# EAGLE design WaldoRevC (EAGLE 7.6.0)

## Sheet 1 of 6: Microcontroller Module
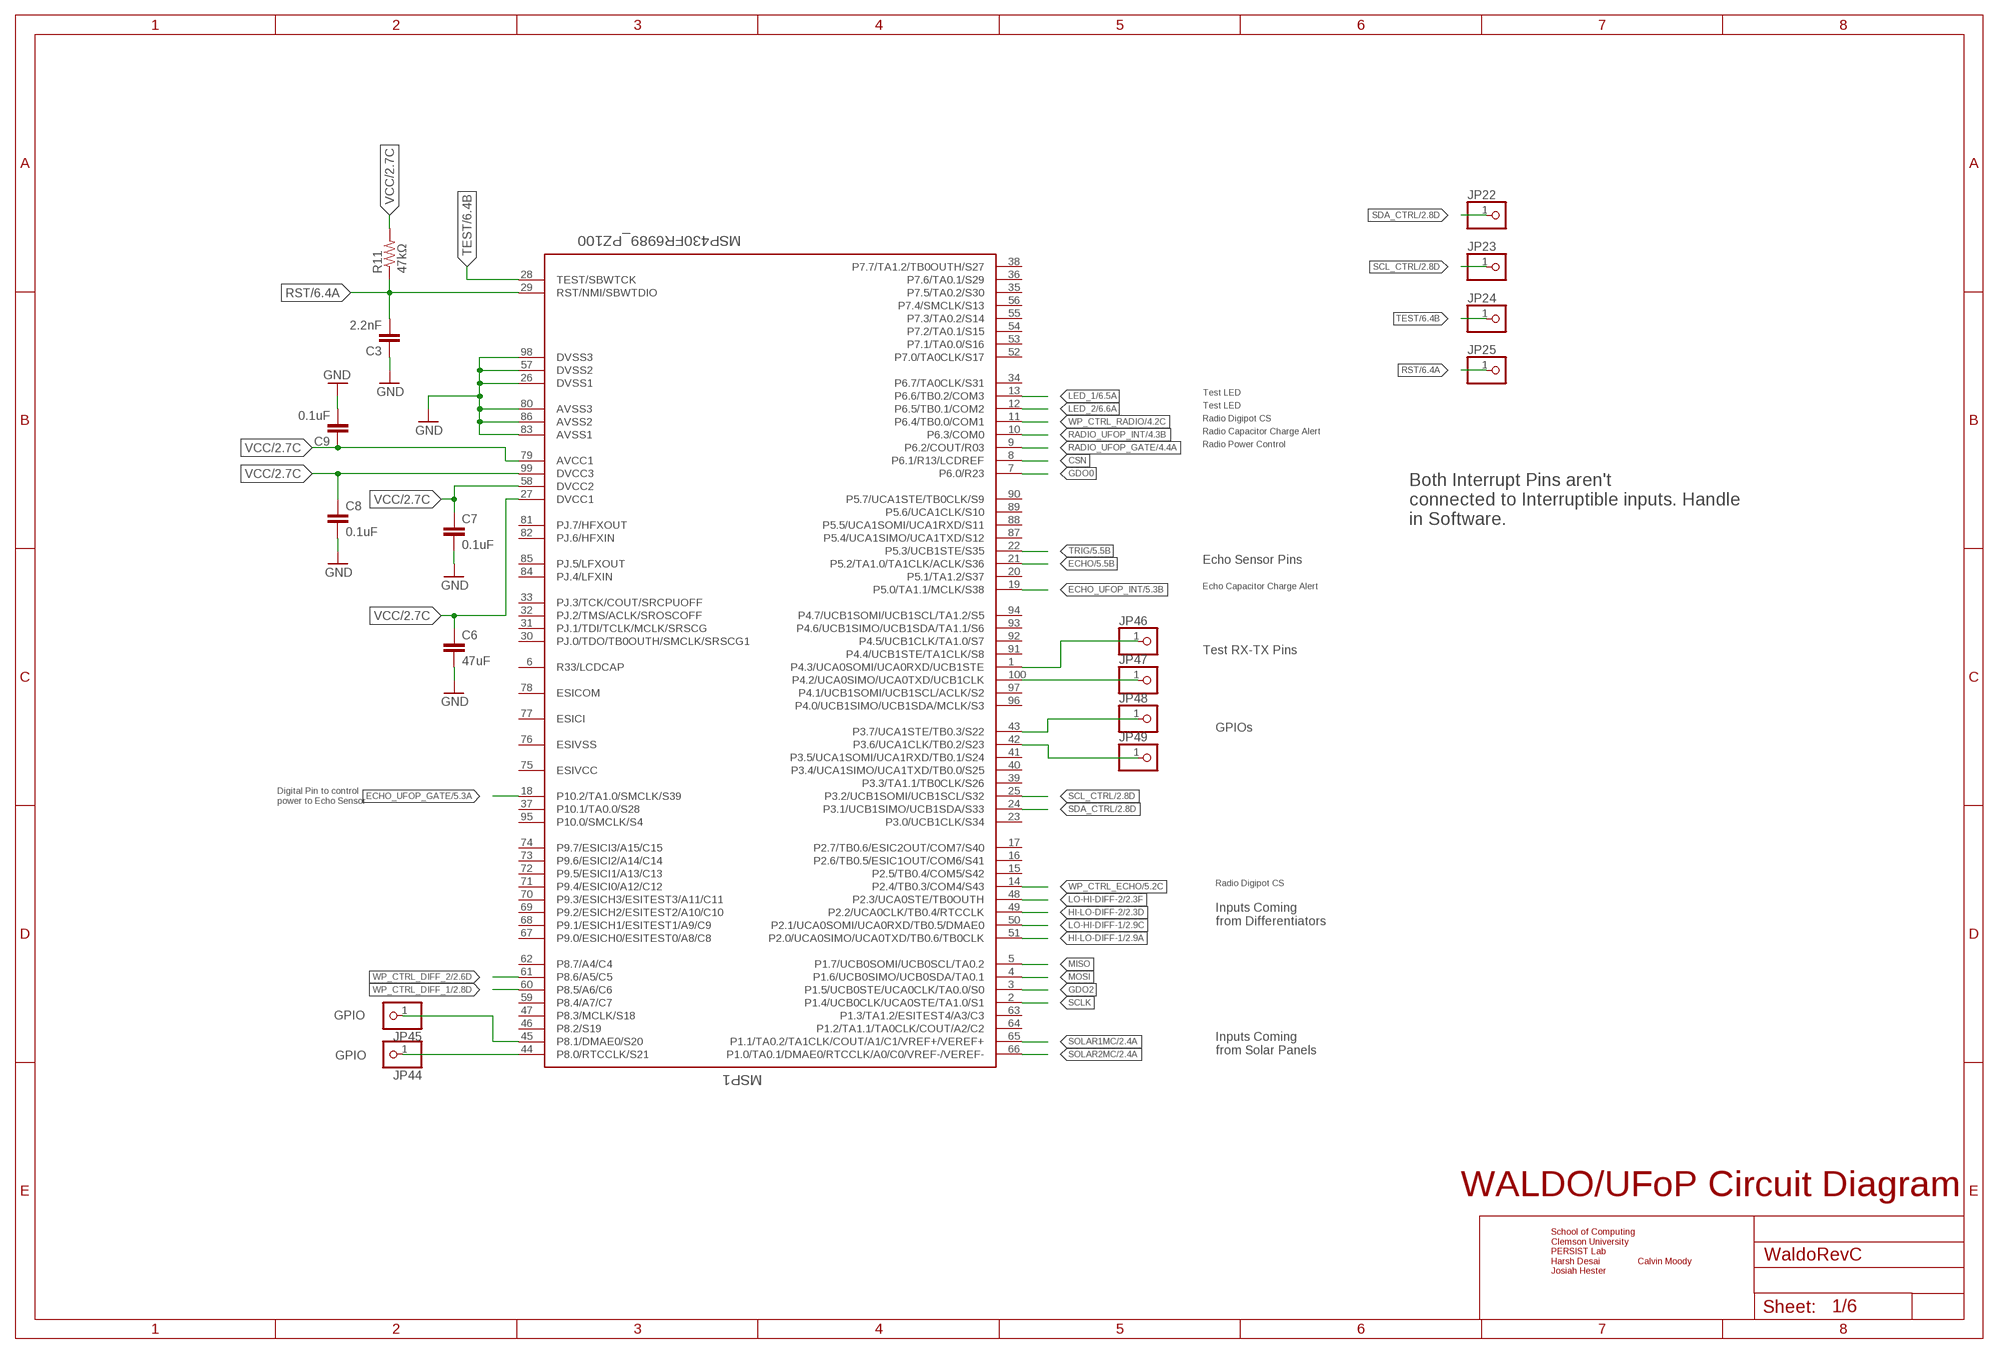
[diagram p0: schematic, sheet 1]

### Parts
C3  2.2nF  CAP0805  [0805]
C6  47uF  CAP0805  [0805]
C7  0.1uF  CAP0805  [0805]
C8  0.1uF  CAP0805  [0805]
C9  0.1uF  CAP0805  [0805]
JP22  PINHD-1X1  [1X01]
JP23  PINHD-1X1  [1X01]
JP24  PINHD-1X1  [1X01]
JP25  PINHD-1X1  [1X01]
JP44  PINHD-1X1  [1X01]
JP45  PINHD-1X1  [1X01]
JP46  PINHD-1X1  [1X01]
JP47  PINHD-1X1  [1X01]
JP48  PINHD-1X1  [1X01]
JP49  PINHD-1X1  [1X01]
MSP1  MSP430FR6989_PZ100  [PZ100]
R11  47kΩ  RESISTOR0805-RES  [0805]

### Nets
CSN: MSP1.8(P6.1/R13/LCDREF) ; also sheet 4
ECHO: MSP1.21(P5.2/TA1.0/TA1CLK/ACLK/S36) ; also sheet 5
ECHO_UFOP_GATE: MSP1.18(P10.2/TA1.0/SMCLK/S39) ; also sheet 5
ECHO_UFOP_INT: MSP1.19(P5.0/TA1.1/MCLK/S38) ; also sheet 5
GDO0: MSP1.7(P6.0/R23) ; also sheet 4
GDO2: MSP1.3(P1.5/UCB0STE/UCA0CLK/TA0.0/S0) ; also sheet 4
GND: C3.1 C6.2 C7.2 C8.2 C9.2 MSP1.26(DVSS1) MSP1.57(DVSS2) MSP1.80(AVSS3) MSP1.83(AVSS1) MSP1.86(AVSS2) MSP1.98(DVSS3) ; also sheet 2,3,4,5,6
HI-LO-DIFF-1: MSP1.51(P2.0/UCA0SIMO/UCA0TXD/TB0.6/TB0CLK) ; also sheet 2
HI-LO-DIFF-2: MSP1.49(P2.2/UCA0CLK/TB0.4/RTCCLK) ; also sheet 2
LED_1: MSP1.13(P6.6/TB0.2/COM3) ; also sheet 6
LED_2: MSP1.12(P6.5/TB0.1/COM2) ; also sheet 6
LO-HI-DIFF-1: MSP1.50(P2.1/UCA0SOMI/UCA0RXD/TB0.5/DMAE0) ; also sheet 2
LO-HI-DIFF-2: MSP1.48(P2.3/UCA0STE/TB0OUTH) ; also sheet 2
MISO: MSP1.5(P1.7/UCB0SOMI/UCB0SCL/TA0.2) ; also sheet 4
MOSI: MSP1.4(P1.6/UCB0SIMO/UCB0SDA/TA0.1) ; also sheet 4
N$1: JP44.1 MSP1.44(P8.0/RTCCLK/S21)
N$2: JP45.1 MSP1.45(P8.1/DMAE0/S20)
N$3: JP46.1 MSP1.1(P4.3/UCA0SOMI/UCA0RXD/UCB1STE)
N$5: JP47.1 MSP1.100(P4.2/UCA0SIMO/UCA0TXD/UCB1CLK)
N$6: JP49.1 MSP1.42(P3.6/UCA1CLK/TB0.2/S23)
N$10: JP48.1 MSP1.43(P3.7/UCA1STE/TB0.3/S22)
RADIO_UFOP_GATE: MSP1.9(P6.2/COUT/R03) ; also sheet 4
RADIO_UFOP_INT: MSP1.10(P6.3/COM0) ; also sheet 4
RST: C3.2 JP25.1 MSP1.29(RST/NMI/SBWTDIO) R11.1 ; also sheet 6
SCL_CTRL: JP23.1 MSP1.25(P3.2/UCB1SOMI/UCB1SCL/S32) ; also sheet 2,4,5,6
SCLK: MSP1.2(P1.4/UCB0CLK/UCA0STE/TA1.0/S1) ; also sheet 4
SDA_CTRL: JP22.1 MSP1.24(P3.1/UCB1SIMO/UCB1SDA/S33) ; also sheet 2,4,5,6
SOLAR1MC: MSP1.65(P1.1/TA0.2/TA1CLK/COUT/A1/C1/VREF+/VEREF+) ; also sheet 2
SOLAR2MC: MSP1.66(P1.0/TA0.1/DMAE0/RTCCLK/A0/C0/VREF-/VEREF-) ; also sheet 2
TEST: JP24.1 MSP1.28(TEST/SBWTCK) ; also sheet 6
TRIG: MSP1.22(P5.3/UCB1STE/S35) ; also sheet 5
VCC: C6.1 C7.1 C8.1 C9.1 MSP1.27(DVCC1) MSP1.58(DVCC2) MSP1.79(AVCC1) MSP1.99(DVCC3) R11.2 ; also sheet 2,3,6
WP_CTRL_DIFF_1: MSP1.60(P8.5/A6/C6) ; also sheet 2
WP_CTRL_DIFF_2: MSP1.61(P8.6/A5/C5) ; also sheet 2
WP_CTRL_ECHO: MSP1.14(P2.4/TB0.3/COM4/S43) ; also sheet 5
WP_CTRL_RADIO: MSP1.11(P6.4/TB0.0/COM1) ; also sheet 4
Unconnected: MSP1.6(R33/LCDCAP) MSP1.15(P2.5/TB0.4/COM5/S42) MSP1.16(P2.6/TB0.5/ESIC1OUT/COM6/S41) MSP1.17(P2.7/TB0.6/ESIC2OUT/COM7/S40) MSP1.20(P5.1/TA1.2/S37) MSP1.23(P3.0/UCB1CLK/S34) MSP1.30(PJ.0/TDO/TB0OUTH/SMCLK/SRSCG1) MSP1.31(PJ.1/TDI/TCLK/MCLK/SRSCG) MSP1.32(PJ.2/TMS/ACLK/SROSCOFF) MSP1.33(PJ.3/TCK/COUT/SRCPUOFF) MSP1.34(P6.7/TA0CLK/S31) MSP1.35(P7.5/TA0.2/S30) MSP1.36(P7.6/TA0.1/S29) MSP1.37(P10.1/TA0.0/S28) MSP1.38(P7.7/TA1.2/TB0OUTH/S27) MSP1.39(P3.3/TA1.1/TB0CLK/S26) MSP1.40(P3.4/UCA1SIMO/UCA1TXD/TB0.0/S25) MSP1.41(P3.5/UCA1SOMI/UCA1RXD/TB0.1/S24) MSP1.46(P8.2/S19) MSP1.47(P8.3/MCLK/S18) MSP1.52(P7.0/TA0CLK/S17) MSP1.53(P7.1/TA0.0/S16) MSP1.54(P7.2/TA0.1/S15) MSP1.55(P7.3/TA0.2/S14) MSP1.56(P7.4/SMCLK/S13) MSP1.59(P8.4/A7/C7) MSP1.62(P8.7/A4/C4) MSP1.63(P1.3/TA1.2/ESITEST4/A3/C3) MSP1.64(P1.2/TA1.1/TA0CLK/COUT/A2/C2) MSP1.67(P9.0/ESICH0/ESITEST0/A8/C8) MSP1.68(P9.1/ESICH1/ESITEST1/A9/C9) MSP1.69(P9.2/ESICH2/ESITEST2/A10/C10) MSP1.70(P9.3/ESICH3/ESITEST3/A11/C11) MSP1.71(P9.4/ESICI0/A12/C12) MSP1.72(P9.5/ESICI1/A13/C13) MSP1.73(P9.6/ESICI2/A14/C14) MSP1.74(P9.7/ESICI3/A15/C15) MSP1.75(ESIVCC) MSP1.76(ESIVSS) MSP1.77(ESICI) MSP1.78(ESICOM) MSP1.81(PJ.7/HFXOUT) MSP1.82(PJ.6/HFXIN) MSP1.84(PJ.4/LFXIN) MSP1.85(PJ.5/LFXOUT) MSP1.87(P5.4/UCA1SIMO/UCA1TXD/S12) MSP1.88(P5.5/UCA1SOMI/UCA1RXD/S11) MSP1.89(P5.6/UCA1CLK/S10) MSP1.90(P5.7/UCA1STE/TB0CLK/S9) MSP1.91(P4.4/UCB1STE/TA1CLK/S8) MSP1.92(P4.5/UCB1CLK/TA1.0/S7) MSP1.93(P4.6/UCB1SIMO/UCB1SDA/TA1.1/S6) MSP1.94(P4.7/UCB1SOMI/UCB1SCL/TA1.2/S5) MSP1.95(P10.0/SMCLK/S4) MSP1.96(P4.0/UCB1SIMO/UCB1SDA/MCLK/S3) MSP1.97(P4.1/UCB1SOMI/UCB1SCL/ACLK/S2)

### Notes on the sheet
- Test LED
- Test LED
- Radio Digipot CS
- Radio Capacitor Charge Alert
- Radio Power Control
- Both Interrupt Pins aren't 
  connected to Interruptible inputs. Handle
  in Software.
- Echo Sensor Pins
- Echo Capacitor Charge Alert
- Test RX-TX Pins
- GPIOs
- Digital Pin to control 
  power to Echo Sensor
- Radio Digipot CS
- Inputs Coming 
  from Differentiators
- GPIO
- Inputs Coming 
  from Solar Panels
- GPIO
- WALDO/UFoP Circuit Diagram
- School of Computing
  Clemson University
  PERSIST Lab
  Harsh Desai               Calvin Moody
  Josiah Hester

## Sheet 2 of 6: Solar Panels + Processing (Differentiators)
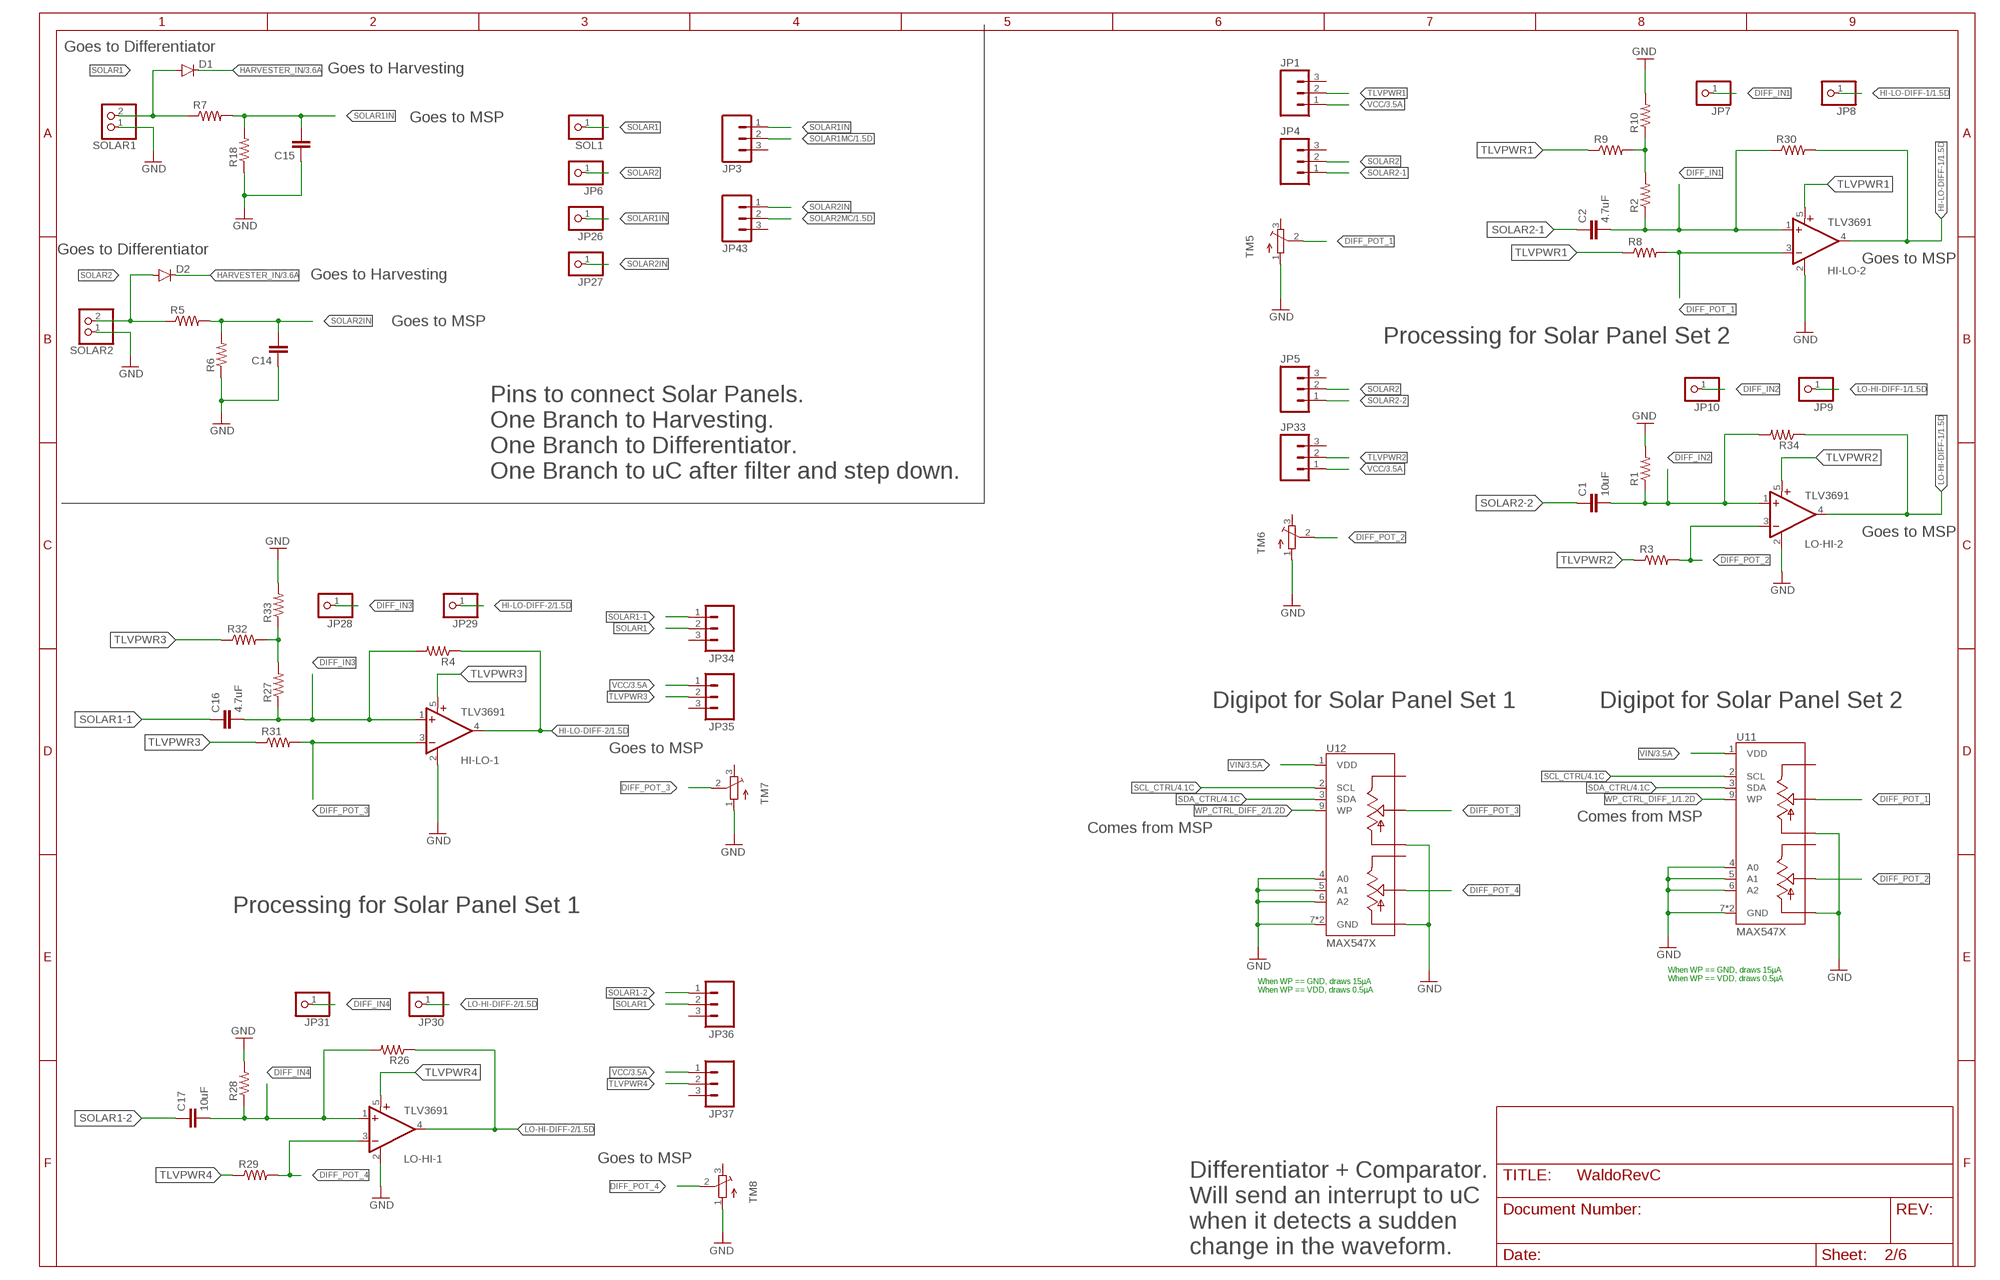
[diagram p1: schematic, sheet 2]

### Parts
C1  10uF  CAP0805  [0805]
C2  4.7uF  CAP0805  [0805]
C14  CAP0805  [0805]
C15  CAP0805  [0805]
C16  4.7uF  CAP0805  [0805]
C17  10uF  CAP0805  [0805]
D1  DIODESOD523  [SOD523]
D2  DIODESOD523  [SOD523]
HI-LO-1  TLV3691  [SC70-5]
HI-LO-2  TLV3691  [SC70-5]
JP1  M03  [1X03-1.27MM]
JP3  M03  [1X03-1.27MM]
JP4  M03  [1X03-1.27MM]
JP5  M03  [1X03-1.27MM]
JP6  PINHD-1X1  [1X01]
JP7  PINHD-1X1  [1X01]
JP8  PINHD-1X1  [1X01]
JP9  PINHD-1X1  [1X01]
JP10  PINHD-1X1  [1X01]
JP26  PINHD-1X1  [1X01]
JP27  PINHD-1X1  [1X01]
JP28  PINHD-1X1  [1X01]
JP29  PINHD-1X1  [1X01]
JP30  PINHD-1X1  [1X01]
JP31  PINHD-1X1  [1X01]
JP33  M03  [1X03-1.27MM]
JP34  M03  [1X03-1.27MM]
JP35  M03  [1X03-1.27MM]
JP36  M03  [1X03-1.27MM]
JP37  M03  [1X03-1.27MM]
JP43  M03  [1X03-1.27MM]
LO-HI-1  TLV3691  [SC70-5]
LO-HI-2  TLV3691  [SC70-5]
R1  RESISTOR0805-RES  [0805]
R2  RESISTOR0805-RES  [0805]
R3  RESISTOR0805-RES  [0805]
R4  RESISTOR0805-RES  [0805]
R5  RESISTOR0805-RES  [0805]
R6  RESISTOR0805-RES  [0805]
R7  RESISTOR0805-RES  [0805]
R8  RESISTOR0805-RES  [0805]
R9  RESISTOR0805-RES  [0805]
R10  RESISTOR0805-RES  [0805]
R18  RESISTOR0805-RES  [0805]
R26  RESISTOR0805-RES  [0805]
R27  RESISTOR0805-RES  [0805]
R28  RESISTOR0805-RES  [0805]
R29  RESISTOR0805-RES  [0805]
R30  RESISTOR0805-RES  [0805]
R31  RESISTOR0805-RES  [0805]
R32  RESISTOR0805-RES  [0805]
R33  RESISTOR0805-RES  [0805]
R34  RESISTOR0805-RES  [0805]
SOL1  PINHD-1X1  [1X01]
SOLAR1  PINHD-1X2  [1X02]
SOLAR2  PINHD-1X2  [1X02]
TM5  TRIMPOTTC33X  [TC33X]
TM6  TRIMPOTTC33X  [TC33X]
TM7  TRIMPOTTC33X  [TC33X]
TM8  TRIMPOTTC33X  [TC33X]
U11  MAX547X  [QFN16]
U12  MAX547X  [QFN16]

### Nets
DIFF_IN1: C2.2 HI-LO-2.1(+IN) JP7.1 R2.1 R30.1
DIFF_IN2: C1.2 JP10.1 LO-HI-2.1(+IN) R1.1 R34.2
DIFF_IN3: C16.2 HI-LO-1.1(+IN) JP28.1 R4.2 R27.1
DIFF_IN4: C17.2 JP31.1 LO-HI-1.1(+IN) R26.2 R28.1
DIFF_POT_1: HI-LO-2.3(-IN) R8.2 TM5.2(S) U11.14(WA)
DIFF_POT_2: LO-HI-2.3(-IN) R3.2 TM6.2(S) U11.11(WB)
DIFF_POT_3: HI-LO-1.3(-IN) R31.2 TM7.2(S) U12.14(WA)
DIFF_POT_4: LO-HI-1.3(-IN) R29.2 TM8.2(S) U12.11(WB)
GND: C14.1 C15.1 HI-LO-1.2(GND) HI-LO-2.2(GND) LO-HI-1.2(GND) LO-HI-2.2(GND) R1.2 R6.1 R10.2 R18.1 R28.2 R33.2 SOLAR1.1 SOLAR2.1 TM5.1(A) TM6.1(A) TM7.1(A) TM8.1(A) U11.4(A0) U11.5(A1) U11.6(A2) U11.7(GND) U11.10(LB) U11.13(LA) U11.TH(GND) U12.4(A0) U12.5(A1) U12.6(A2) U12.7(GND) U12.10(LB) U12.13(LA) U12.TH(GND) ; also sheet 1,3,4,5,6
HARVESTER_IN: D1.C D2.C ; also sheet 3
HI-LO-DIFF-1: HI-LO-2.4(OUT) JP8.1 R30.2 ; also sheet 1
HI-LO-DIFF-2: HI-LO-1.4(OUT) JP29.1 R4.1 ; also sheet 1
LO-HI-DIFF-1: JP9.1 LO-HI-2.4(OUT) R34.1 ; also sheet 1
LO-HI-DIFF-2: JP30.1 LO-HI-1.4(OUT) R26.1 ; also sheet 1
N$4: R27.2 R32.2 R33.1
N$8: R2.2 R9.2 R10.1
SCL_CTRL: U11.2(SCL) U12.2(SCL) ; also sheet 1,4,5,6
SDA_CTRL: U11.3(SDA) U12.3(SDA) ; also sheet 1,4,5,6
SOLAR1: D1.A JP34.2 JP36.2 R7.1 SOL1.1 SOLAR1.2
SOLAR1-1: C16.1 JP34.1
SOLAR1-2: C17.1 JP36.1
SOLAR1IN: C15.2 JP3.1 JP26.1 R7.2 R18.2
SOLAR1MC: JP3.2 ; also sheet 1
SOLAR2: D2.A JP4.2 JP5.2 JP6.1 R5.1 SOLAR2.2
SOLAR2-1: C2.1 JP4.1
SOLAR2-2: C1.1 JP5.1
SOLAR2IN: C14.2 JP27.1 JP43.1 R5.2 R6.2
SOLAR2MC: JP43.2 ; also sheet 1
TLVPWR1: HI-LO-2.5(V+) JP1.2 R8.1 R9.1
TLVPWR2: JP33.2 LO-HI-2.5(V+) R3.1
TLVPWR3: HI-LO-1.5(V+) JP35.2 R31.1 R32.1
TLVPWR4: JP37.2 LO-HI-1.5(V+) R29.1
VCC: JP1.1 JP33.1 JP35.1 JP37.1 ; also sheet 1,3,6
VIN: U11.1(VDD) U12.1(VDD) ; also sheet 3,4,5,6
WP_CTRL_DIFF_1: U11.9(WP) ; also sheet 1
WP_CTRL_DIFF_2: U12.9(WP) ; also sheet 1
Unconnected: JP1.3 JP3.3 JP4.3 JP5.3 JP33.3 JP34.3 JP35.3 JP36.3 JP37.3 JP43.3 TM5.3(E) TM6.3(E) TM7.3(E) TM8.3(E) U11.12(HB) U11.15(HA) U12.12(HB) U12.15(HA)

### Notes on the sheet
- Goes to Differentiator
- Goes to Harvesting
- Goes to MSP
- Goes to Differentiator
- Goes to MSP
- Goes to Harvesting
- Goes to MSP
- Processing for Solar Panel Set 2
- Pins to connect Solar Panels.
  One Branch to Harvesting.
  One Branch to Differentiator.
  One Branch to uC after filter and step down.
- Goes to MSP
- Digipot for Solar Panel Set 1 | Digipot for Solar Panel Set 2
- Goes to MSP
- Comes from MSP
- Comes from MSP
- Processing for Solar Panel Set 1
- When WP == GND, draws 15µA
  When WP == VDD, draws 0.5µA
- When WP == GND, draws 15µA
  When WP == VDD, draws 0.5µA
- Goes to MSP
- Differentiator + Comparator.
  Will send an interrupt to uC 
  when it detects a sudden 
  change in the waveform.

## Sheet 3 of 6: Battery + Regulator
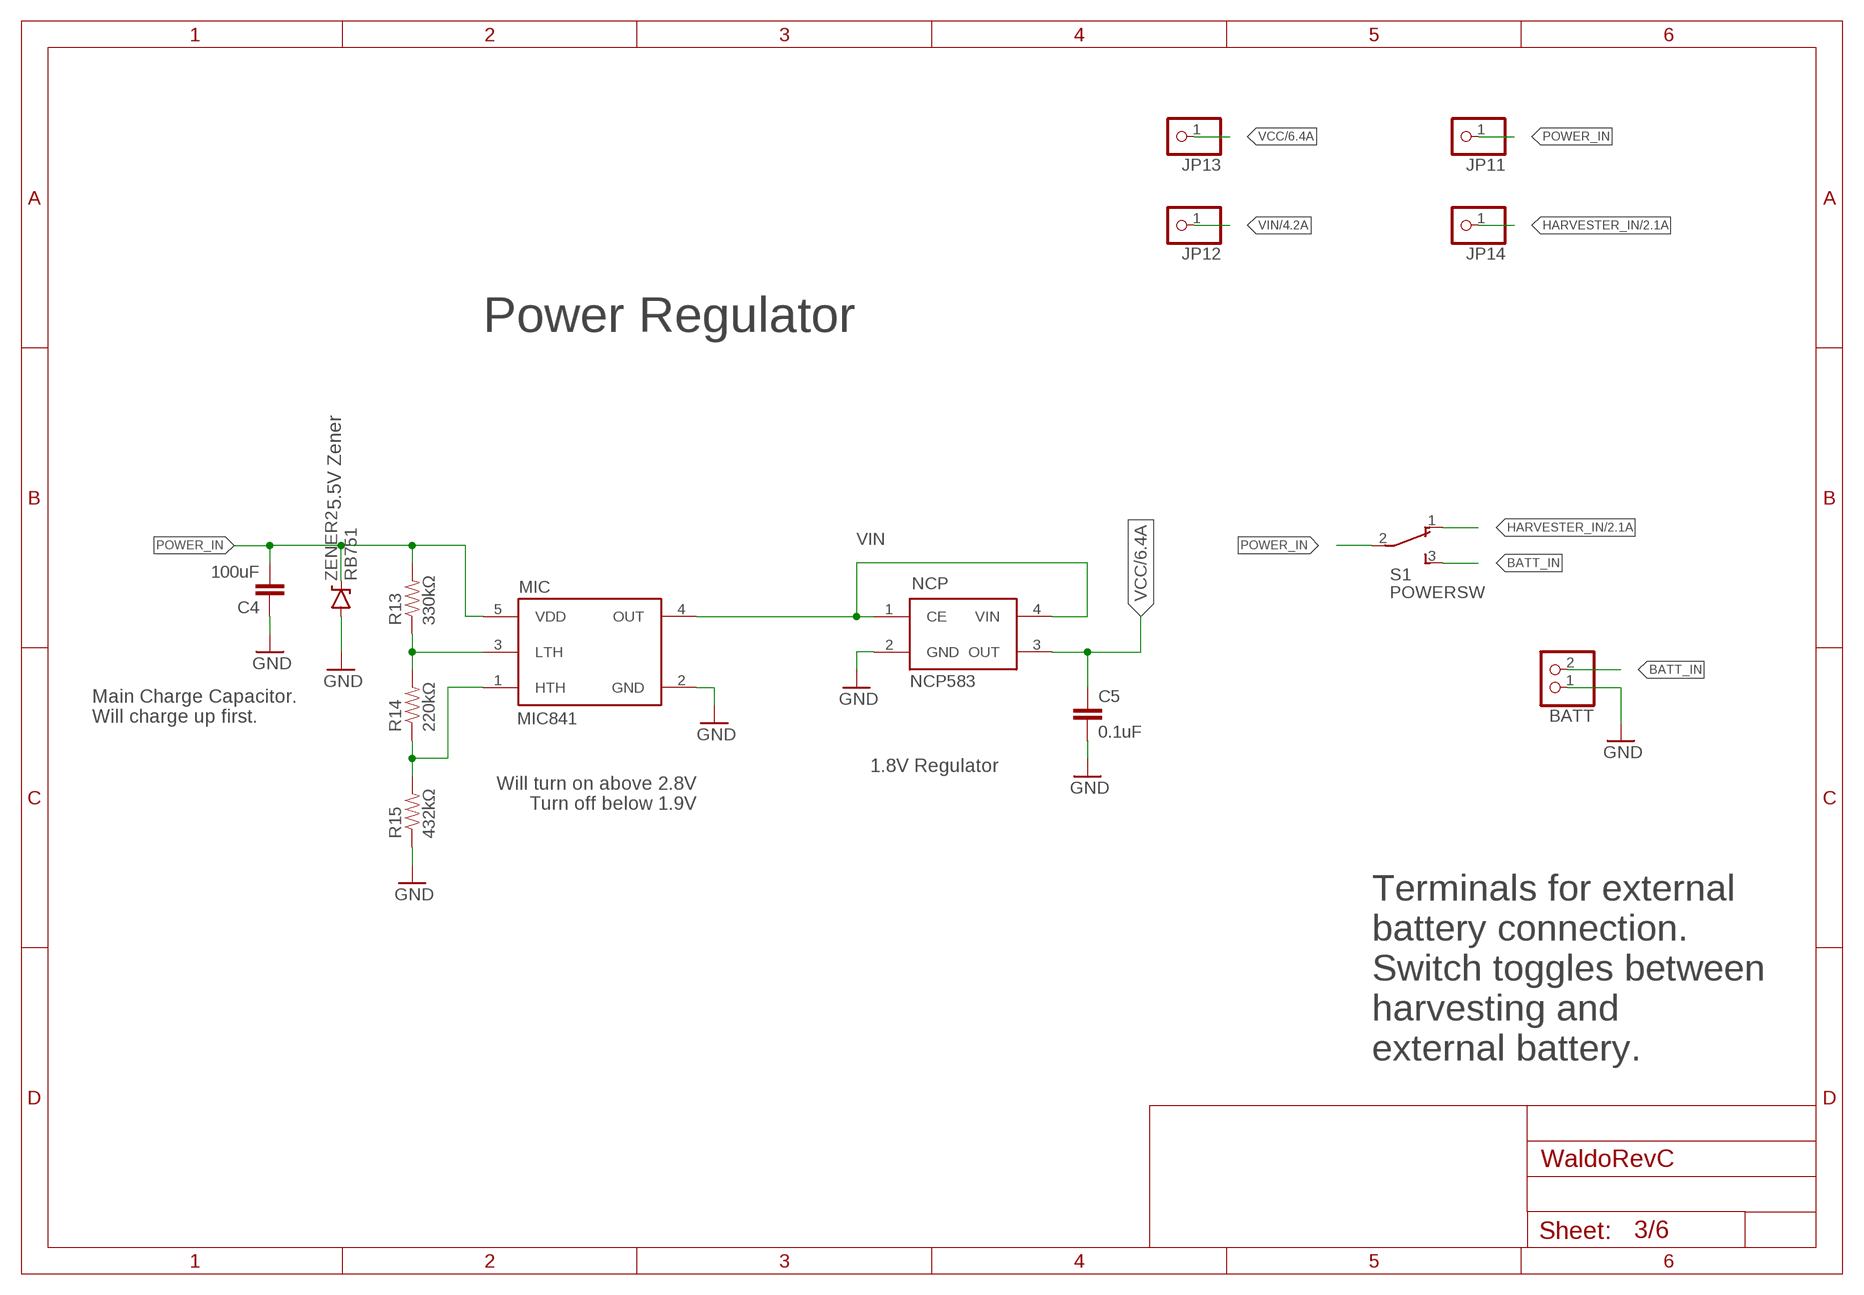
[diagram p2: schematic, sheet 3]

### Parts
BATT  PINHD-1X2  [1X02]
C4  100uF  CAP0805  [0805]
C5  0.1uF  CAP0805  [0805]
JP11  PINHD-1X1  [1X01]
JP12  PINHD-1X1  [1X01]
JP13  PINHD-1X1  [1X01]
JP14  PINHD-1X1  [1X01]
MIC  MIC841  [SC70-5]
NCP  NCP583  [SC82-AB_1PRIMARY]
R13  330kΩ  RESISTOR0805-RES  [0805]
R14  220kΩ  RESISTOR0805-RES  [0805]
R15  432kΩ  RESISTOR0805-RES  [0805]
S1  POWERSW  [TL3XYO]
ZENER2  RB751  DIODE-ZENER  [SOD-523]

### Nets
BATT_IN: BATT.2 S1.3(S)
GND: BATT.1 C4.1 C5.2 MIC.2(GND) NCP.2(GND) R15.1 ZENER2.ANODE(A) ; also sheet 1,2,4,5,6
HARVESTER_IN: JP14.1 S1.1(O) ; also sheet 2
N$11: MIC.3(LTH) R13.1 R14.2
N$12: MIC.1(HTH) R14.1 R15.2
POWER_IN: C4.2 JP11.1 MIC.5(VDD) R13.2 S1.2(P) ZENER2.CATHODE(C)
VCC: C5.1 JP13.1 NCP.3(OUT) ; also sheet 1,2,6
VIN: JP12.1 MIC.4(OUT) NCP.1(CE) NCP.4(VIN) ; also sheet 2,4,5,6

### Notes on the sheet
- Power Regulator
- 5.5V Zener
- Main Charge Capacitor.
  Will charge up first.
- 1.8V Regulator
- Will turn on above 2.8V
  Turn off below 1.9V
- Terminals for external
  battery connection.
  Switch toggles between
  harvesting and 
  external battery.

## Sheet 4 of 6: Radio Module
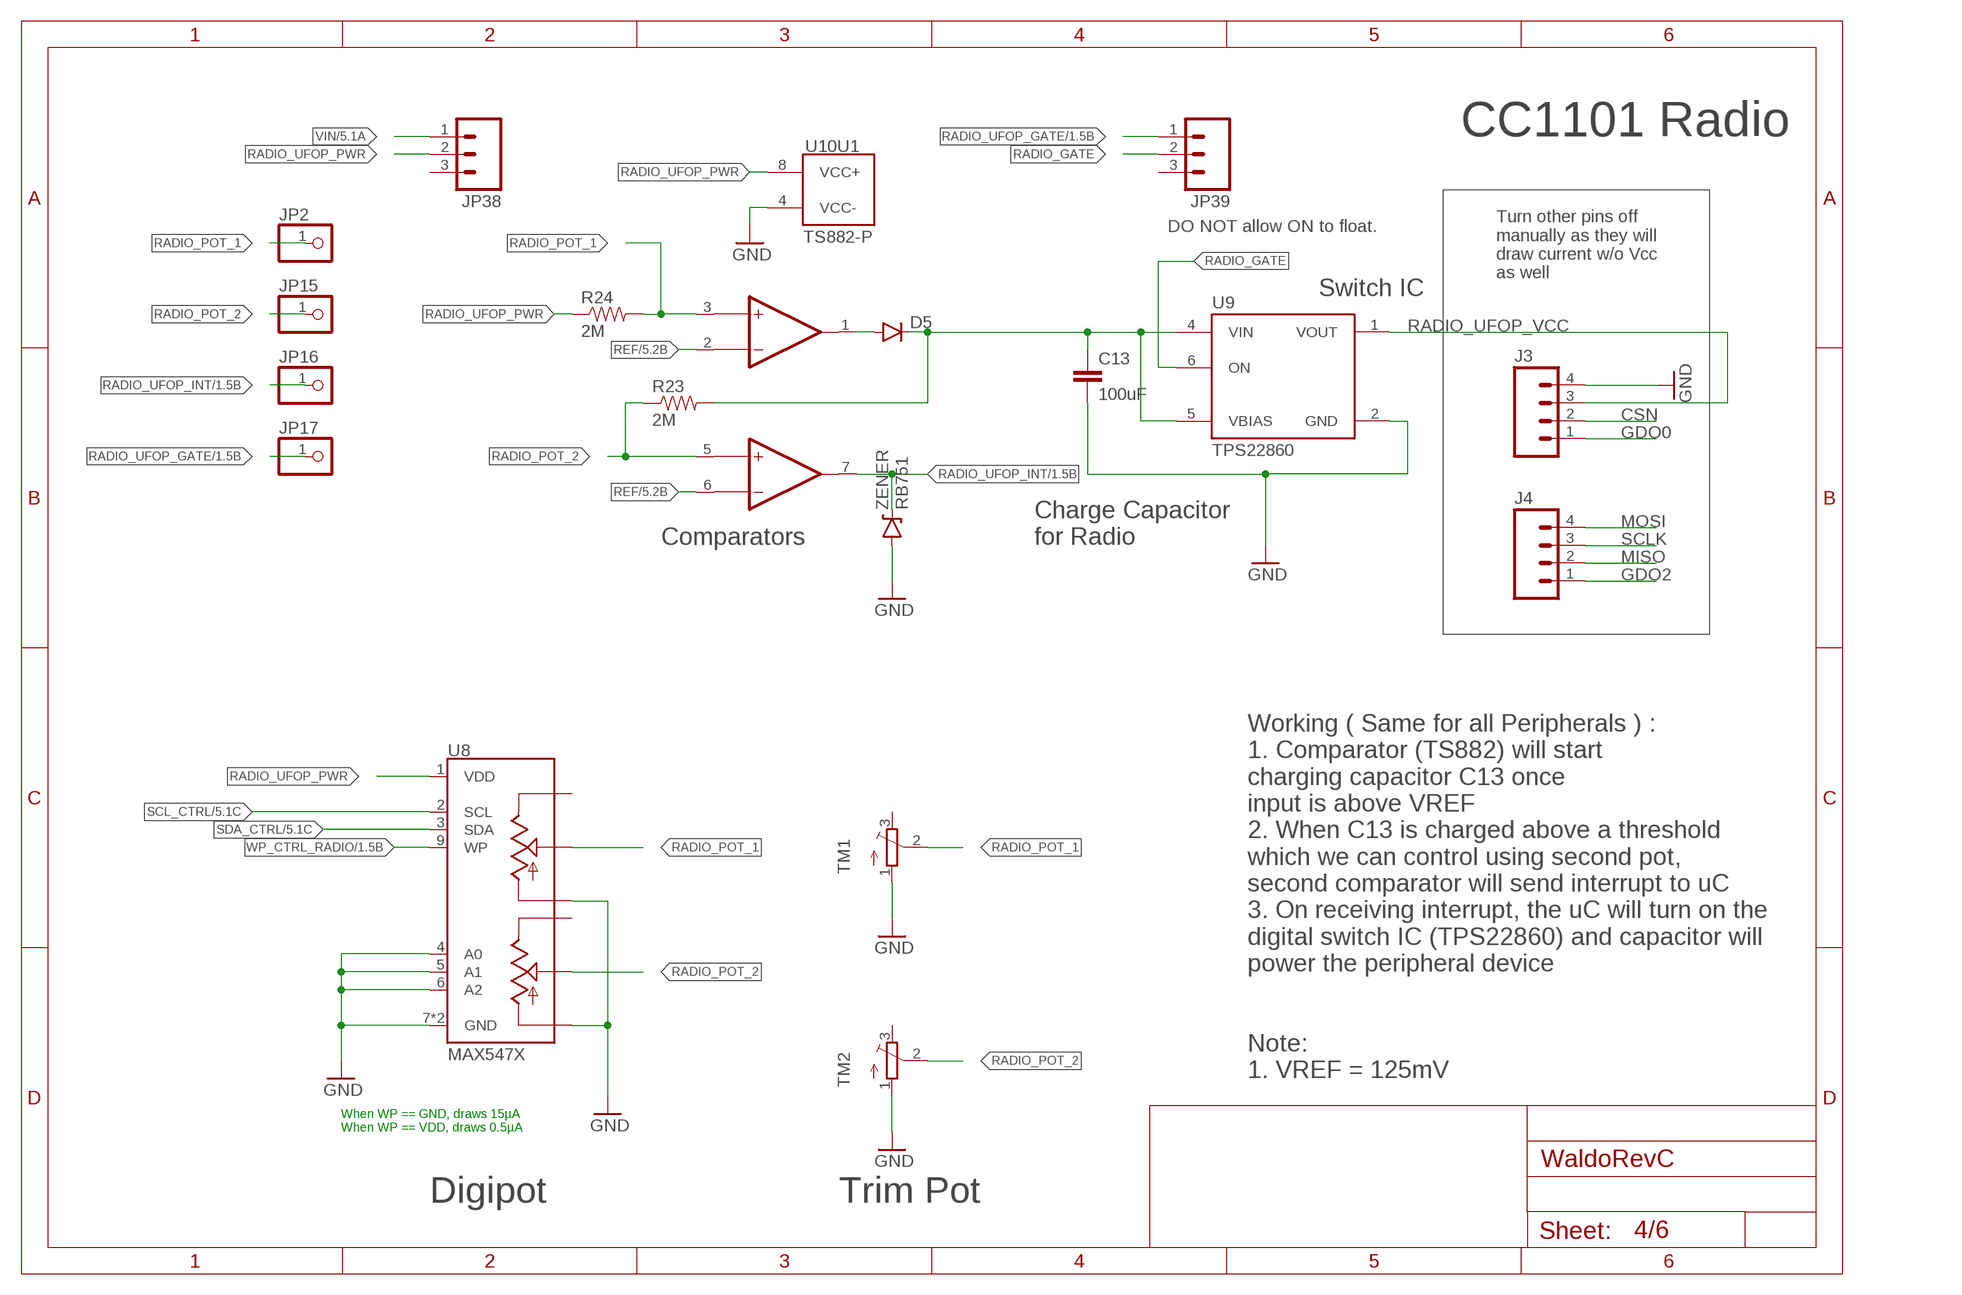
[diagram p3: schematic, sheet 4]

### Parts
C13  100uF  CAP0805  [0805]
D5  DIODESOD523  [SOD523]
J3  M04PTH  [1X04]
J4  M04PTH  [1X04]
JP2  PINHD-1X1  [1X01]
JP15  PINHD-1X1  [1X01]
JP16  PINHD-1X1  [1X01]
JP17  PINHD-1X1  [1X01]
JP38  M03  [1X03-1.27MM]
JP39  M03  [1X03-1.27MM]
R23  2M  RESISTOR0805-RES  [0805]
R24  2M  RESISTOR0805-RES  [0805]
TM1  TRIMPOTTC33X  [TC33X]
TM2  TRIMPOTTC33X  [TC33X]
U8  MAX547X  [QFN16]
U9  TPS22860  [TSOT23-6]
U10  TS882-P  [UDFN8]
ZENER  RB751  DIODE-ZENER  [SOD-523]

### Nets
CSN: J3.2 ; also sheet 1
GDO0: J3.1 ; also sheet 1
GDO2: J4.1 ; also sheet 1
GND: C13.2 J3.4 TM1.1(A) TM2.1(A) U8.4(A0) U8.5(A1) U8.6(A2) U8.7(GND) U8.10(LB) U8.13(LA) U8.TH(GND) U9.2(GND) U10.4(U1:VCC-) ZENER.ANODE(A) ; also sheet 1,2,3,5,6
MISO: J4.2 ; also sheet 1
MOSI: J4.4 ; also sheet 1
N$22: C13.1 D5.C R23.2 U9.4(VIN) U9.5(VBIAS)
N$24: D5.A U10.1(OP1:OUT1)
RADIO_GATE: JP39.2 U9.6(ON)
RADIO_POT_1: JP2.1 R24.2 TM1.2(S) U8.14(WA) U10.3(OP1:IN1+)
RADIO_POT_2: JP15.1 R23.1 TM2.2(S) U8.11(WB) U10.5(OP2:IN1+)
RADIO_UFOP_GATE: JP17.1 JP39.1 ; also sheet 1
RADIO_UFOP_INT: JP16.1 U10.7(OP2:OUT1) ZENER.CATHODE(C) ; also sheet 1
RADIO_UFOP_PWR: JP38.2 R24.1 U8.1(VDD) U10.8(U1:VCC+)
RADIO_UFOP_VCC: J3.3 U9.1(VOUT)
REF: U10.2(OP1:IN1-) U10.6(OP2:IN1-) ; also sheet 5,6
SCL_CTRL: U8.2(SCL) ; also sheet 1,2,5,6
SCLK: J4.3 ; also sheet 1
SDA_CTRL: U8.3(SDA) ; also sheet 1,2,5,6
VIN: JP38.1 ; also sheet 2,3,5,6
WP_CTRL_RADIO: U8.9(WP) ; also sheet 1
Unconnected: JP38.3 JP39.3 TM1.3(E) TM2.3(E) U8.12(HB) U8.15(HA)

### Notes on the sheet
- CC1101 Radio
- DO NOT allow ON to float.
- Turn other pins off 
  manually as they will
  draw current w/o Vcc
  as well
- Switch IC
- Comparators
- Charge Capacitor 
  for Radio
- Working ( Same for all Peripherals ) :
  1. Comparator (TS882) will start 
  charging capacitor C13 once 
  input is above VREF
  2. When C13 is charged above a threshold
  which we can control using second pot, 
  second comparator will send interrupt to uC
  3. On receiving interrupt, the uC will turn on the
  digital switch IC (TPS22860) and capacitor will 
  power the peripheral device
- Note:
  1. VREF = 125mV
- When WP == GND, draws 15µA
  When WP == VDD, draws 0.5µA
- Digipot | Trim Pot

## Sheet 5 of 6: Echo Sensor Module
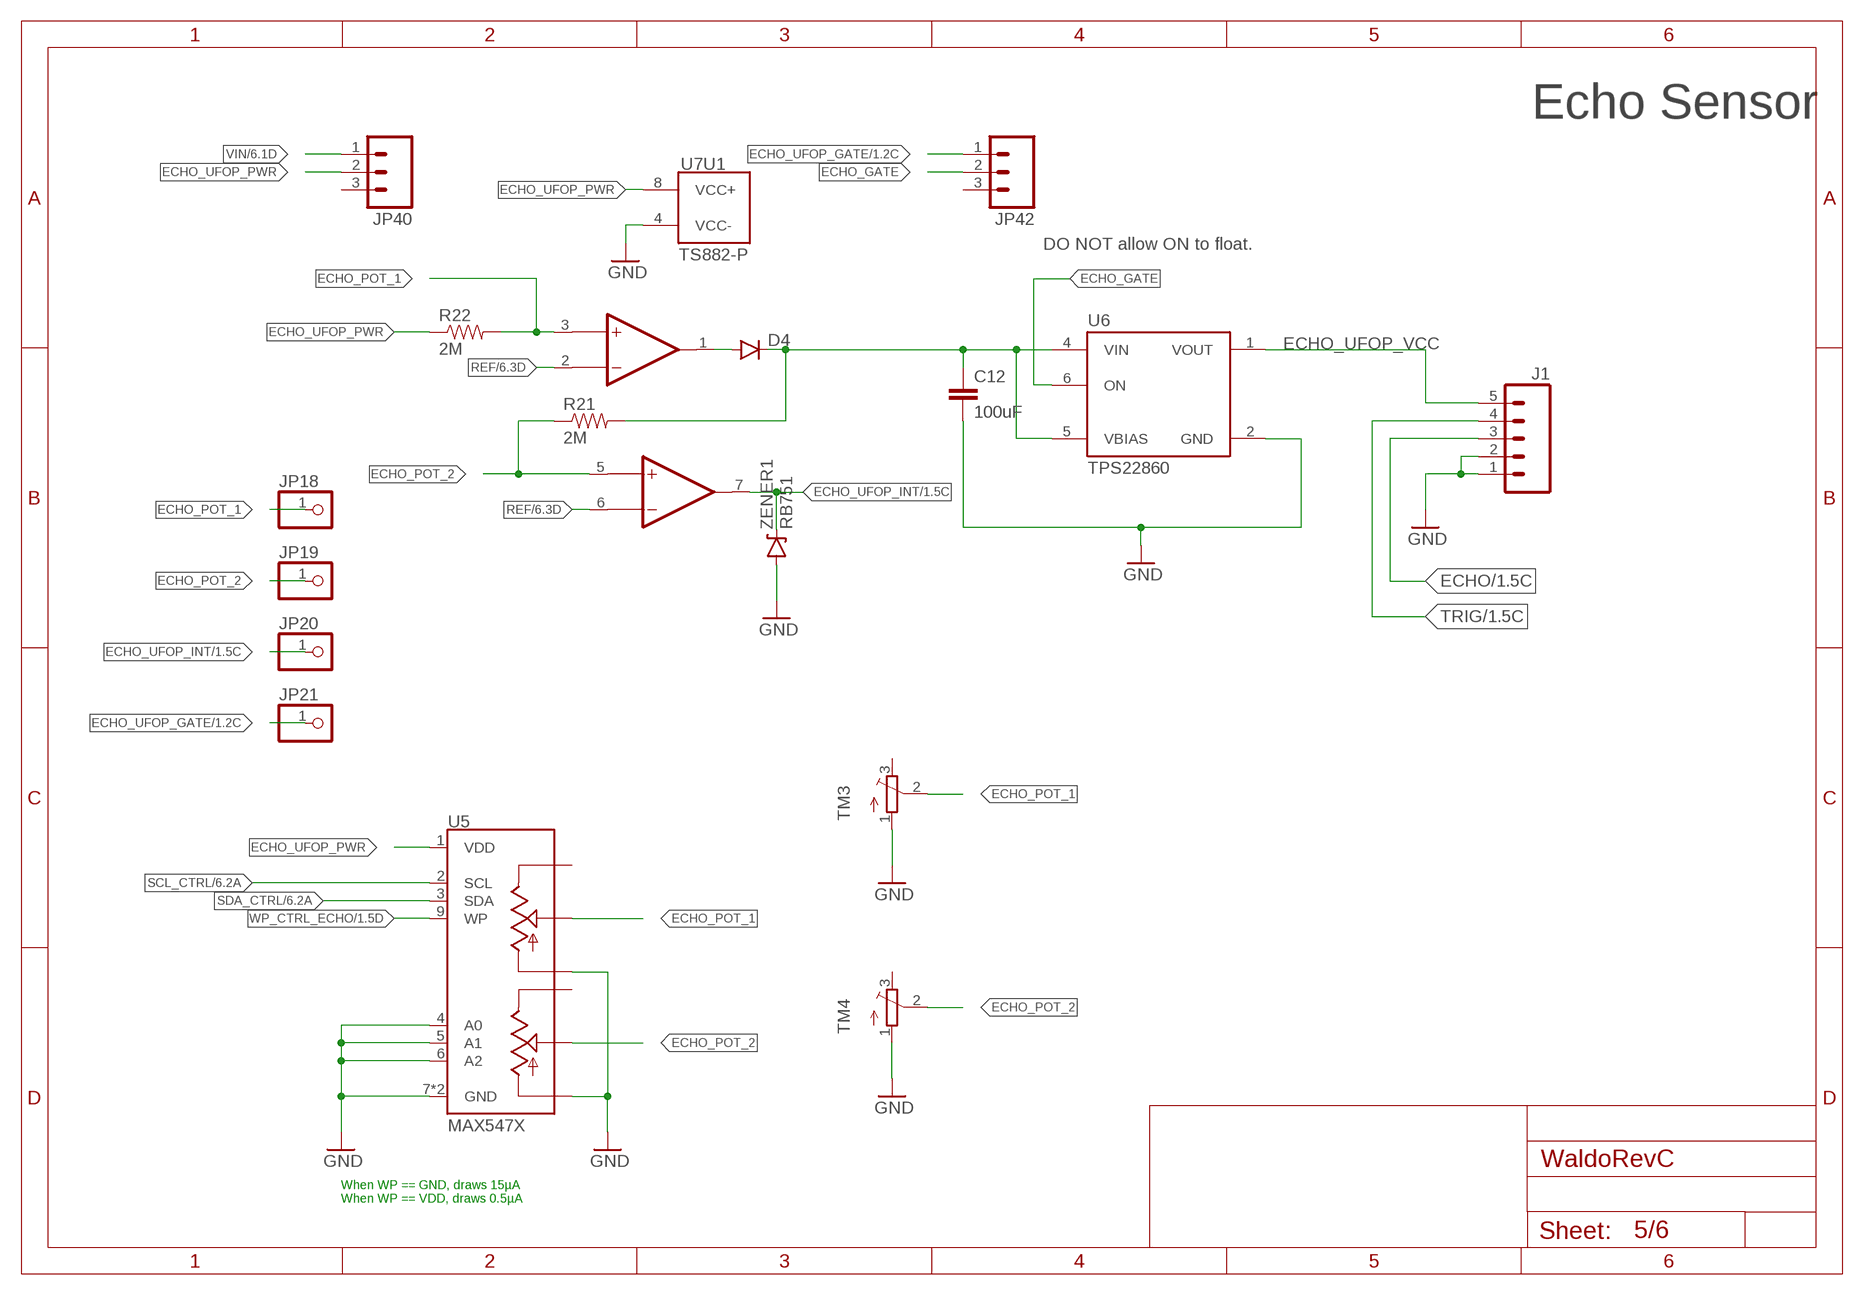
[diagram p4: schematic, sheet 5]

### Parts
C12  100uF  CAP0805  [0805]
D4  DIODESOD523  [SOD523]
J1  M05PTH  [1X05]
JP18  PINHD-1X1  [1X01]
JP19  PINHD-1X1  [1X01]
JP20  PINHD-1X1  [1X01]
JP21  PINHD-1X1  [1X01]
JP40  M03  [1X03-1.27MM]
JP42  M03  [1X03-1.27MM]
R21  2M  RESISTOR0805-RES  [0805]
R22  2M  RESISTOR0805-RES  [0805]
TM3  TRIMPOTTC33X  [TC33X]
TM4  TRIMPOTTC33X  [TC33X]
U5  MAX547X  [QFN16]
U6  TPS22860  [TSOT23-6]
U7  TS882-P  [UDFN8]
ZENER1  RB751  DIODE-ZENER  [SOD-523]

### Nets
ECHO: J1.3 ; also sheet 1
ECHO_GATE: JP42.2 U6.6(ON)
ECHO_POT_1: JP18.1 R22.2 TM3.2(S) U5.14(WA) U7.3(OP1:IN1+)
ECHO_POT_2: JP19.1 R21.1 TM4.2(S) U5.11(WB) U7.5(OP2:IN1+)
ECHO_UFOP_GATE: JP21.1 JP42.1 ; also sheet 1
ECHO_UFOP_INT: JP20.1 U7.7(OP2:OUT1) ZENER1.CATHODE(C) ; also sheet 1
ECHO_UFOP_PWR: JP40.2 R22.1 U5.1(VDD) U7.8(U1:VCC+)
ECHO_UFOP_VCC: J1.5 U6.1(VOUT)
GND: C12.2 J1.1 J1.2 TM3.1(A) TM4.1(A) U5.4(A0) U5.5(A1) U5.6(A2) U5.7(GND) U5.10(LB) U5.13(LA) U5.TH(GND) U6.2(GND) U7.4(U1:VCC-) ZENER1.ANODE(A) ; also sheet 1,2,3,4,6
N$17: C12.1 D4.C R21.2 U6.4(VIN) U6.5(VBIAS)
N$20: D4.A U7.1(OP1:OUT1)
REF: U7.2(OP1:IN1-) U7.6(OP2:IN1-) ; also sheet 4,6
SCL_CTRL: U5.2(SCL) ; also sheet 1,2,4,6
SDA_CTRL: U5.3(SDA) ; also sheet 1,2,4,6
TRIG: J1.4 ; also sheet 1
VIN: JP40.1 ; also sheet 2,3,4,6
WP_CTRL_ECHO: U5.9(WP) ; also sheet 1
Unconnected: JP40.3 JP42.3 TM3.3(E) TM4.3(E) U5.12(HB) U5.15(HA)

### Notes on the sheet
- Echo Sensor
- DO NOT allow ON to float.
- When WP == GND, draws 15µA
  When WP == VDD, draws 0.5µA

## Sheet 6 of 6: Programmer, RTC, Misc
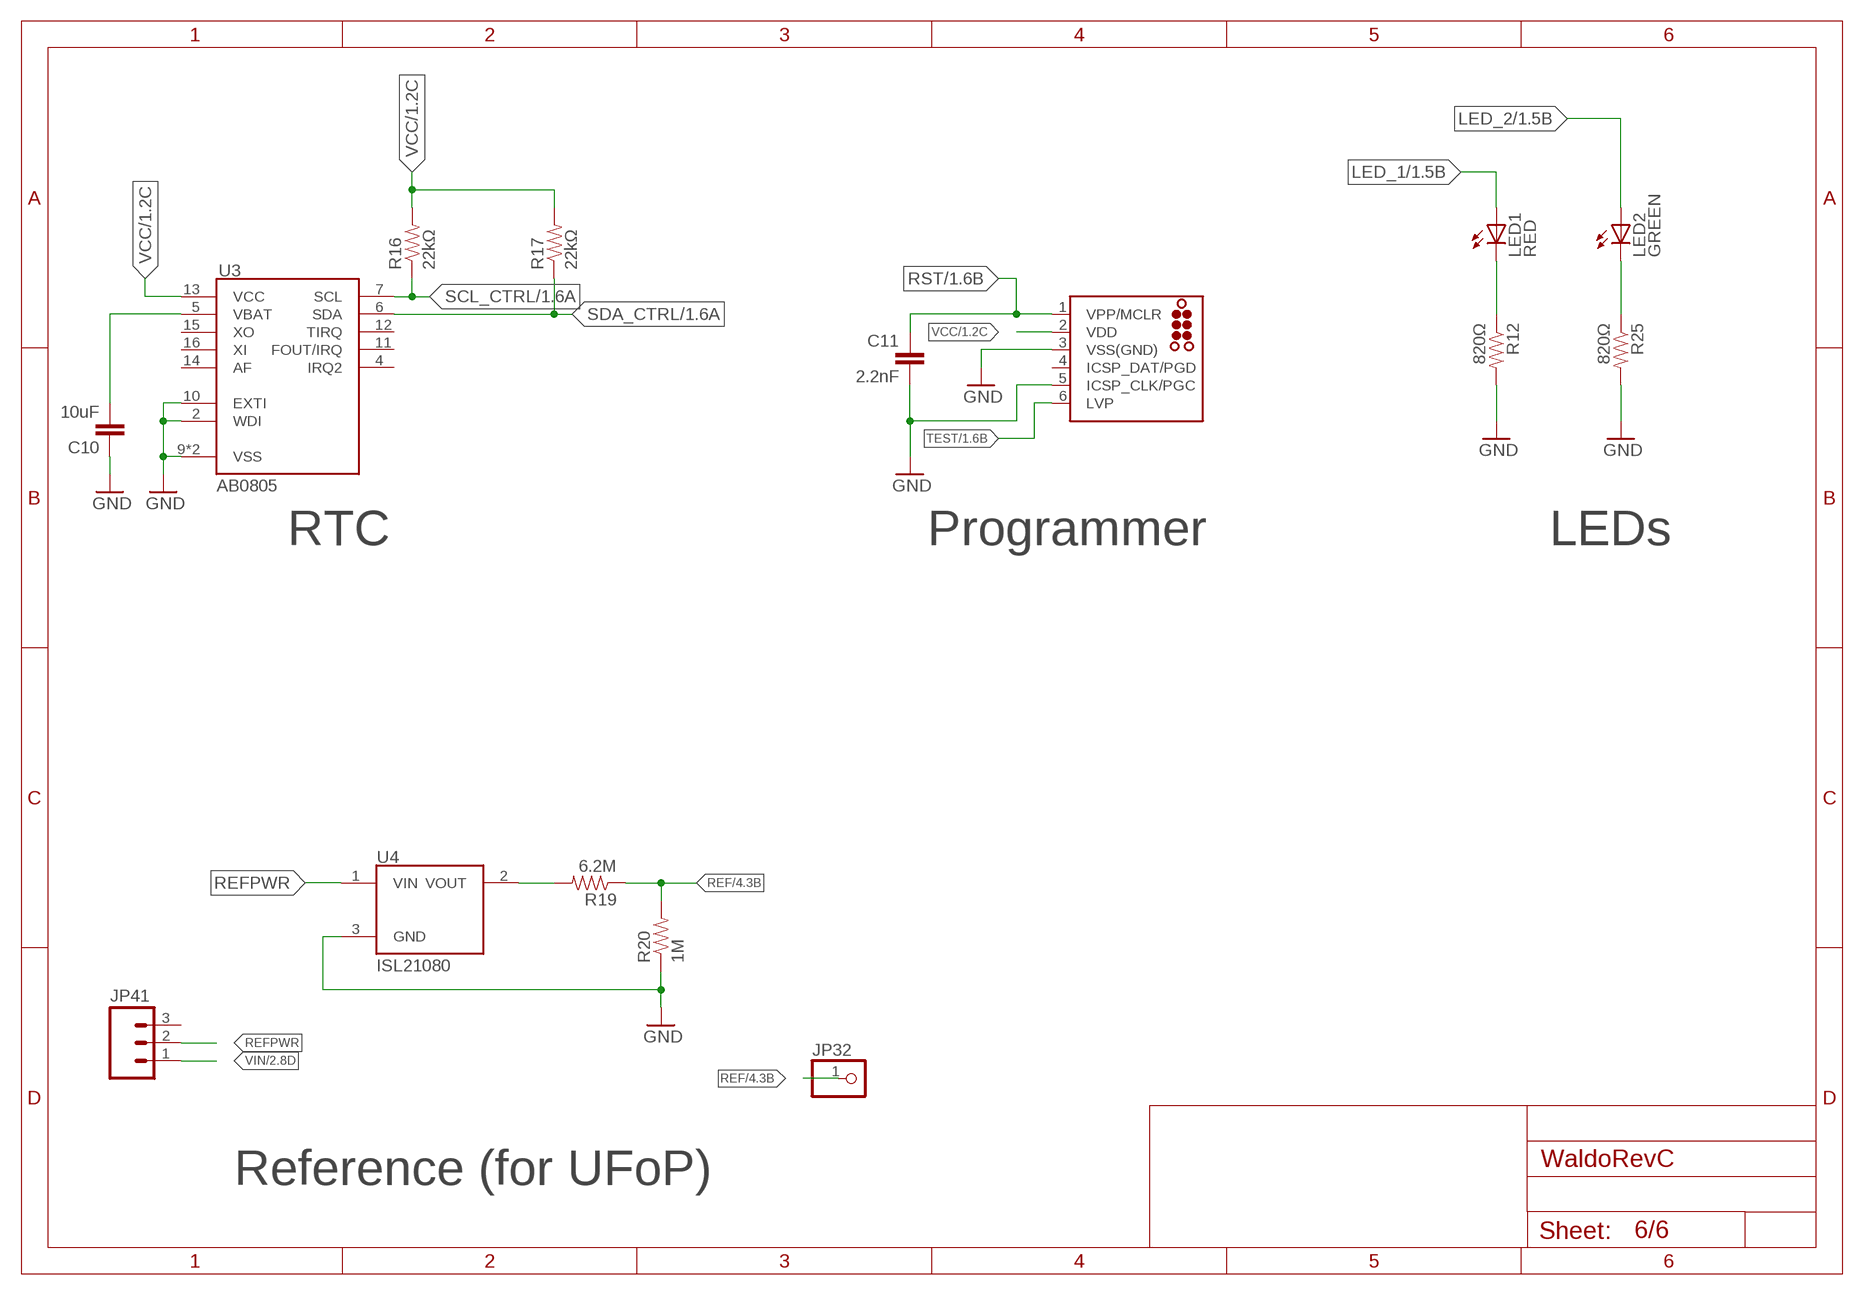
[diagram p5: schematic, sheet 6]

### Parts
C10  10uF  CAP0805  [0805]
C11  2.2nF  CAP0805  [0805]
J2  TC2030-MCP-NL  [TC2030-MCP-NL]
JP32  PINHD-1X1  [1X01]
JP41  M03  [1X03-1.27MM]
LED1  RED  LEDCHIP-LED0805  [CHIP-LED0805]
LED2  GREEN  LEDCHIP-LED0805  [CHIP-LED0805]
R12  820Ω  RESISTOR0805-RES  [0805]
R16  22kΩ  RESISTOR0805-RES  [0805]
R17  22kΩ  RESISTOR0805-RES  [0805]
R19  6.2M  RESISTOR0805-RES  [0805]
R20  1M  RESISTOR0805-RES  [0805]
R25  820Ω  RESISTOR0805-RES  [0805]
U3  AB0805  [QFN16]
U4  ISL21080  [SOT-23]

### Nets
GND: C10.1 C11.2 J2.3(VSS(GND)) J2.5(ICSP_CLK/PGC) R12.2 R20.1 R25.2 U3.2(WDI) U3.9(VSS) U3.10(EXTI) U3.TH(VSS) U4.3(GND) ; also sheet 1,2,3,4,5
LED_1: LED1.A ; also sheet 1
LED_2: LED2.A ; also sheet 1
N$7: LED1.C R12.1
N$9: LED2.C R25.1
N$13: C10.2 U3.5(VBAT)
N$14: R19.2 U4.2(VOUT)
REF: JP32.1 R19.1 R20.2 ; also sheet 4,5
REFPWR: JP41.2 U4.1(VIN)
RST: C11.1 J2.1(VPP/MCLR) ; also sheet 1
SCL_CTRL: R16.1 U3.7(SCL) ; also sheet 1,2,4,5
SDA_CTRL: R17.1 U3.6(SDA) ; also sheet 1,2,4,5
TEST: J2.6(LVP) ; also sheet 1
VCC: J2.2(VDD) R16.2 R17.2 U3.13(VCC) ; also sheet 1,2,3
VIN: JP41.1 ; also sheet 2,3,4,5
Unconnected: J2.4(ICSP_DAT/PGD) JP41.3 U3.4(IRQ2) U3.11(FOUT/IRQ) U3.12(TIRQ) U3.14(AF) U3.15(XO) U3.16(XI)

### Notes on the sheet
- RTC | Programmer | LEDs
- Reference (for UFoP)

## Library data of the parts
BATT SOLAR1 SOLAR2 = pinhead:PINHD-1X2: PIN HEADER
C1-C11 C14-C17 = SparkFun-Capacitors:CAP: Capacitor Standard 0603 ceramic capacitor, and 0.1" leaded capacitor.
C12 C13 = SparkFun-Capacitors:CAP: Capacitor Standard 0603 ceramic capacitor, and 0.1" leaded capacitor.; DIGIKEY: 490-9969-1-ND
D1 D2 D4 D5 = SparkFun-DiscreteSemi:DIODE: Diode These are standard reverse protection diodes and small signal diodes. SMA package can handle up to about 1A. SOD-323 can handle about 200mA. What the SOD-323 package when ordering, there are some mfgs out there that are 5-pin packages.
HI-LO-1 HI-LO-2 LO-HI-1 LO-HI-2 = fedpower:TLV3691: 0.9-V to 6.5-V, Nanopower Comparator Datasheets Analog Signal Chain Guide <http://www.ti.com/lit/pdf/slyb174> TLV3691 <http://www.ti.com/lit/ds/symlink/tlv3691.pdf> Manufacturer Product Page TLV3691IDPFR Specifications <http://www.ti.com/general/docs/suppproductinfo.tsp?distId=10&orderablePartNumber=TLV3691IDPFR> Standard Package <javascript:dlgHelp('Standard%20Packaging%20Help');> 1 Category Integrated Circuits (ICs) </product-search/en/integrated-circuits-ics> Family Linear - Comparators </product-search/en/integrated-circuits-ics/linear-comparators/2556221> Series - Packaging <javascript:dlgHelp('Standard%20Packaging%20Help');> Cut Tape (CT) <javascript:dlgHelp('Cut%20Tape%20Help');> Type General Purpose Number of Elements 1 Output Type Push-Pull Voltage - Supply, Single/Dual (±) 0.9 V ~ 6.5 V, ±0.45 V ~ 3.25 V Voltage - Input Offset (Max) 3mV Current - Input Bias (Max) 100pA Current - Output (Typ) 42mA Current - Quiescent (Max) 150nA CMRR, PSRR (Typ) - Propagation Delay (Max) 35µs Hysteresis - Operating Temperature -40°C ~ 125°C Package / Case 6-XFDFN Mounting Type Surface Mount Supplier Device Package 6-X2SON (1x1) Online Catalog Comparators - 1 element </catalog/en/partgroup/comparators-1-element/3112?mpart=TLV3691IDPFR&vendor=296&WT.z_ref_page_type=PS&WT.z_ref_page_sub_type=PD&WT.z_ref_page_id=PD&WT.z_ref_page_event=DC_Link_Table> Other Names 296-37242-1
J1 = SparkFun-Connectors:M05: Header 5 Standard 5-pin 0.1" header. Use with straight break away headers (SKU : PRT-00116), right angle break away headers (PRT-00553), swiss pins (PRT-00743), machine pins (PRT-00117), and female headers (PRT-00115). Molex polarized connector foot print use with SKU : PRT-08230 with associated crimp pins and housings.
J2 = tag-connect_msp430:TC2030: TAG-CONNECT ICSP Connector Manufacturer: Tag-Connect <http://www.tag-connect.com> Cable for easy In-Circuit Serial Programming. Designed for Microchip ICD2, suitable for many others. Two variants - one "with legs" (for hands-free fit on PCB) and another "without legs" for quick programming. PAD Description 1 MCLR/Vpp 2 Vdd 3 GND 4 PGD (ISPDAT) 5 PGC (ISPCLK) 6 nc (used for LVP) ©2009 ROFA.cz - modified and updated by Robert Darlington ‹rdarlington@gmail.com›
J3 J4 = SparkFun-Connectors:M04: Header 4 Standard 4-pin 0.1" header. Use with straight break away headers (SKU : PRT-00116), right angle break away headers (PRT-00553), swiss pins (PRT-00743), machine pins (PRT-00117), and female headers (PRT-00115). Molex polarized connector foot print use with SKU : PRT-08231 with associated crimp pins and housings. 1MM SMD Version SKU: PRT-10208; PROD_ID: CONN-09696
JP1 JP3-JP5 JP33-JP43 = SparkFun-Connectors:M03: Header 3 Standard 3-pin 0.1" header. Use with straight break away headers (SKU : PRT-00116), right angle break away headers (PRT-00553), swiss pins (PRT-00743), machine pins (PRT-00117), and female headers (PRT-00115). Molex polarized connector foot print use with SKU : PRT-08232 with associated crimp pins and housings.
JP2 JP6-JP32 JP44-JP49 SOL1 = adafruit:PINHD-1X1: Pin header 1x1 for 0.1" spacing With round pins
LED1 LED2 = led:LED: LED OSRAM: - CHIPLED LG R971, LG N971, LY N971, LG Q971, LY Q971, LO R971, LY R971 LH N974, LH R974 LS Q976, LO Q976, LY Q976 LO Q996 - Hyper CHIPLED LW Q18S LB Q993, LB Q99A, LB R99A - SideLED LS A670, LO A670, LY A670, LG A670, LP A670 LB A673, LV A673, LT A673, LW A673 LH A674 LY A675 LS A676, LA A676, LO A676, LY A676, LW A676 LS A679, LY A679, LG A679 - Hyper Micro SIDELED® LS Y876, LA Y876, LO Y876, LY Y876 LT Y87S - SmartLED LW L88C, LW L88S LB L89C, LB L89S, LG L890 LS L89K, LO L89K, LY L89K LS L896, LA L896, LO L896, LY L896 - TOPLED LS T670, LO T670, LY T670, LG T670, LP T670 LSG T670, LSP T670, LSY T670, LOP T670, LYG T670 LG T671, LOG T671, LSG T671 LB T673, LV T673, LT T673, LW T673 LH T674 LS T676, LA T676, LO T676, LY T676, LB T676, LH T676, LSB T676, LW T676 LB T67C, LV T67C, LT T67C, LS T67K, LO T67K, LY T67K, LW E67C LS E67B, LA E67B, LO E67B, LY E67B, LB E67C, LV E67C, LT E67C LW T67C LS T679, LY T679, LG T679 LS T770, LO T770, LY T770, LG T770, LP T770 LB T773, LV T773, LT T773, LW T773 LH T774 LS E675, LA E675, LY E675, LS T675 LS T776, LA T776, LO T776, LY T776, LB T776 LHGB T686 LT T68C, LB T68C - Hyper Mini TOPLED® LB M676 - Mini TOPLED Santana® LG M470 LS M47K, LO M47K, LY M47K Source: http://www.osram.convergy.de LUXEON: - LUMILED® LXK2-PW12-R00, LXK2-PW12-S00, LXK2-PW14-U00, LXK2-PW14-V00 LXK2-PM12-R00, LXK2-PM12-S00, LXK2-PM14-U00 LXK2-PE12-Q00, LXK2-PE12-R00, LXK2-PE12-S00, LXK2-PE14-T00, LXK2-PE14-U00 LXK2-PB12-K00, LXK2-PB12-L00, LXK2-PB12-M00, LXK2-PB14-N00, LXK2-PB14-P00, LXK2-PB14-Q00 LXK2-PR12-L00, LXK2-PR12-M00, LXK2-PR14-Q00, LXK2-PR14-R00 LXK2-PD12-Q00, LXK2-PD12-R00, LXK2-PD12-S00 LXK2-PH12-R00, LXK2-PH12-S00 LXK2-PL12-P00, LXK2-PL12-Q00, LXK2-PL12-R00 Source: www.luxeon.com KINGBRIGHT: KA-3528ASYC Source: www.kingbright.com
MIC = mic841:MIC841: MIC841:Comparator with reference and adj. hysteresis
MSP1 = msp430:MSP430FR6989_PZ100
NCP = ncp583:NCP583: NCP583 - Ultra-Low Iq 150 mA CMOS LDO Regulator with Enable The NCP583 series of low dropout regulators are designed for portable battery powered applications which require precise output voltage accuracy and low quiescent current. These devices feature an enable function which lowers current consumption significantly and are offered in two small packages; SC−82AB and the SOT−563. A 1.0 mF ceramic capacitor is the recommended value to be used with these devices on the output pin.
R1-R18 R22 R24-R34 = SparkFun-Resistors:RESISTOR: Resistor Basic schematic elements and footprints for 0603, 1206, and PTH resistors.
R19 = SparkFun-Resistors:RESISTOR: Resistor Basic schematic elements and footprints for 0603, 1206, and PTH resistors.; DIGIKEY: 541-6.20MHCT-ND
R20 = SparkFun-Resistors:RESISTOR: Resistor Basic schematic elements and footprints for 0603, 1206, and PTH resistors.; DIGIKEY: 311-1.00MHRCT-ND
R21 R23 = SparkFun-Resistors:RESISTOR: Resistor Basic schematic elements and footprints for 0603, 1206, and PTH resistors.; DIGIKEY: 311-2.00MHRCT-ND
S1 = GreenBoard:POWERSW: TINY SWITCH ON - ON Source: http://www2.produktinfo.conrad.com/datenblaetter/700000-724999/705152-da-01-de-Subminiaturschalter_TL_36YO.pdf
TM1-TM8 = adafruit:TRIMPOT: SMT trimmer potentiometer part number TC33X http://www.ladyada.net/library/eagle
U3 = AB08XX:AB0805: AB08X5 Real-Time Clock Family: I2C Version The ABRACON AB08X5 Real-Time Clock family provides a groundbreaking combination of ultra-low power coupled with a highly sophisticated feature set. With power requirements significantly lower than any other industry RTC (as low as 14 nA), these are the first semiconductors based on innovative SPOTTM (Subthreshold Power Optimized Technology) CMOS platform. The AB08X5 includes on-chip oscillators to provide minimum power consumption, full RTC functions including battery backup and programmable counters and alarms for timer and watchdog functions, and either an I2C or SPI serial interface for communication with a host controller.; MOUSER: 815-AB0805-T3
U4 = isl21080:ISL21080: Intersil: ISL21080, 300nA NanoPower Voltage References The ISL21080 analog voltage references feature low supply voltage operation at ultra-low 310nA typ, 1.5µA max operating current. Additionally, the ISL21080 family features guaranteed initial accuracy as low as ±0.2% and 50ppm/°C temperature coefficient. These references are ideal for general purpose portable applications to extend battery life at lower cost. The ISL21080 is provided in the industry standard 3 Ld SOT-23 pinout. The ISL21080 output voltages can be used as precision voltage sources for voltage monitors, control loops, standby voltages for low power states for DSP, FPGA, Datapath Controllers, microcontrollers and other core voltages: 0.9V, 1.024V, 1.25V, 1.5V, 2.048V, 2.5V, 3.0V, 3.3V, 4.096V and 5.0V. Special Note: Post-assembly x-ray inspection may lead to permanent changes in device output voltage and should be minimized or avoided. For further information, please see “Applications Information” on page 14 and AN1533, “X-Ray Effects on Intersil FGA References”.; DIGIKEY: ISL21080DIH309Z-TKCT-ND
U5 U8 U11 U12 = max547x:MAX547X: MAXIM MAX547X: Dual, 256-Tap, Nonvolatile, I2C-Interface, Digital Potentiometers, 400nA Iq, 250µA 12ms write The MAX5477/MAX5478/MAX5479 nonvolatile, dual, linear-taper, digital potentiometers perform the function of a mechanical potentiometer, but replace the mechanics with a simple 2-wire digital interface. Each device performs the same function as a discrete potentiometer or variable resistor and has 256 tap points. The devices feature an internal, nonvolatile EEPROM used to store the wiper position for initialization during power-up. A write-protect feature prevents accidental overwrites of the EEPROM. The fast-mode I2C-compatible serial interface allows communication at data rates up to 400kbps, minimizing board space and reducing interconnection complexity in many applications. Three address inputs allow a total of eight unique address combinations.; DIGIKEY: MAX5479ETE+-ND
U6 U9 = tps22860:TPS22860: TI: TPS22860 Ultra-Low Leakage Load Switch The TPS22860 is a small, ultra-low leakage current, single channel load switch. The device requires a VBIAS voltage and can operate over an input voltage range of 0 V to VBIAS. It can support a maximum continuous current of 200 mA. The switch is controlled by an on/off input (ON), which is capable of interfacing directly with low-voltage control signals. The TPS22860 is available in two small, space-saving 6-pin SOT-23 and SC70 packages. The device is characterized for operation over the free-air temperature range of –40°C to 85°C.; DIGIKEY: 296-43982-1-ND
U7 U10 = ts882:TS882-P; DIGIKEY: 497-14073-1-ND
ZENER ZENER1 ZENER2 = Parts:DIODE-ZENER: Zener Diode Production Part - 8199 3.4V Zener Voltage

## Board
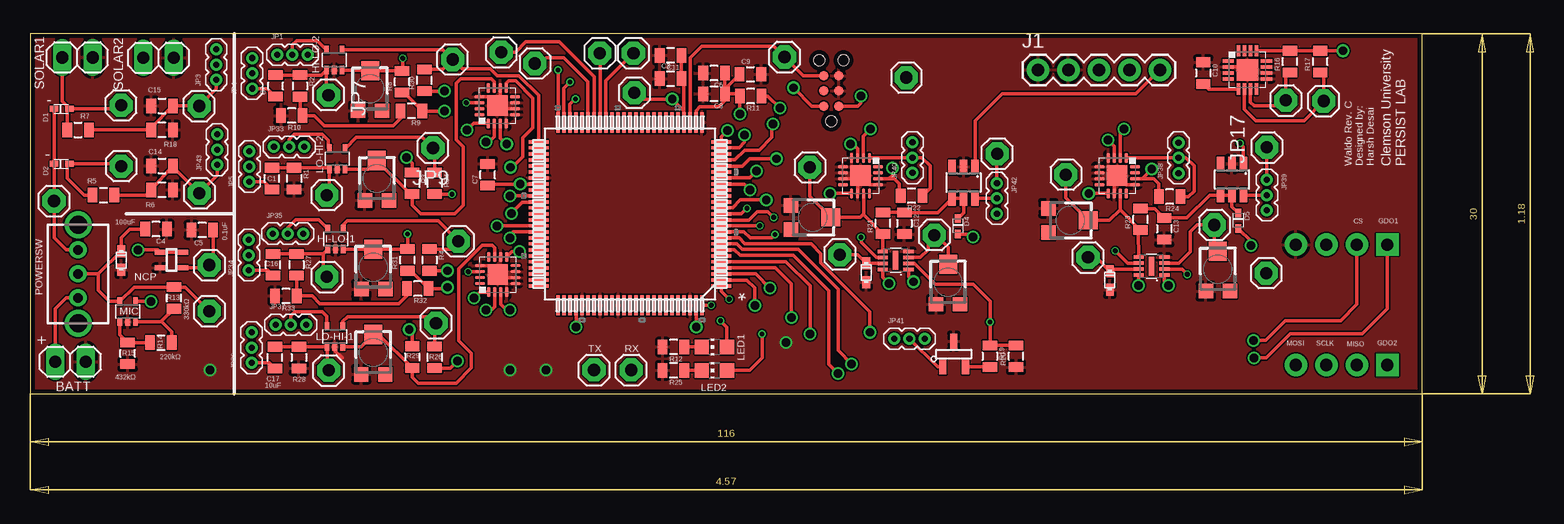
[diagram p6: board, top side]
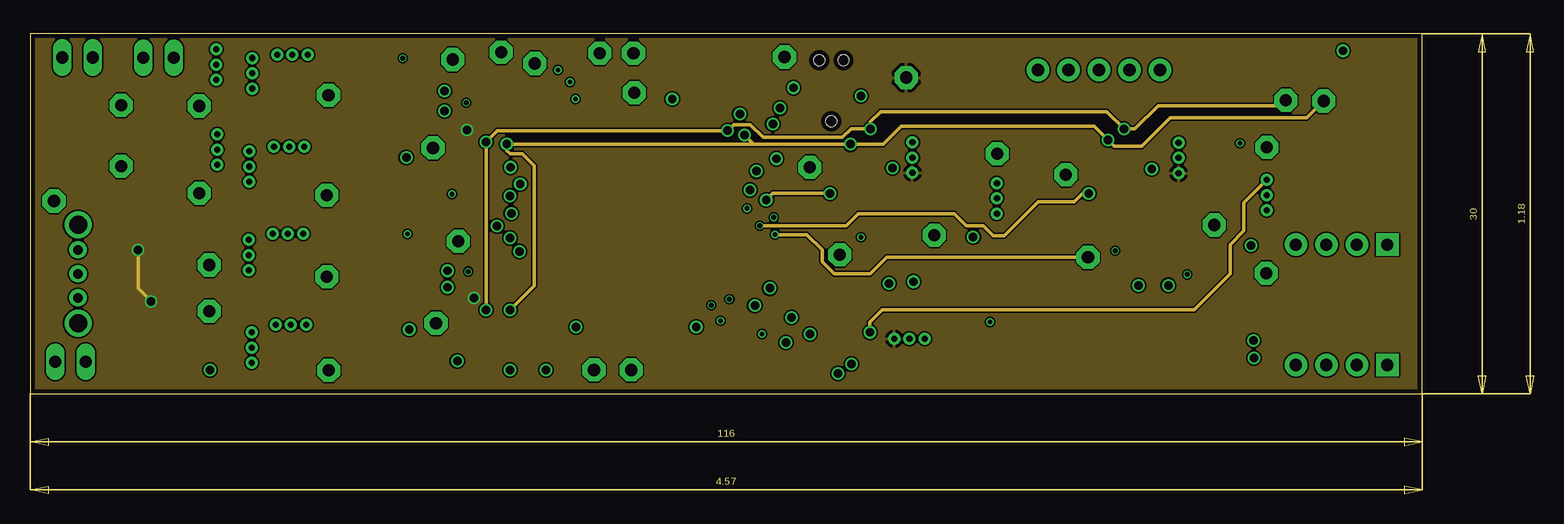
[diagram p7: board, inner layer Route2]
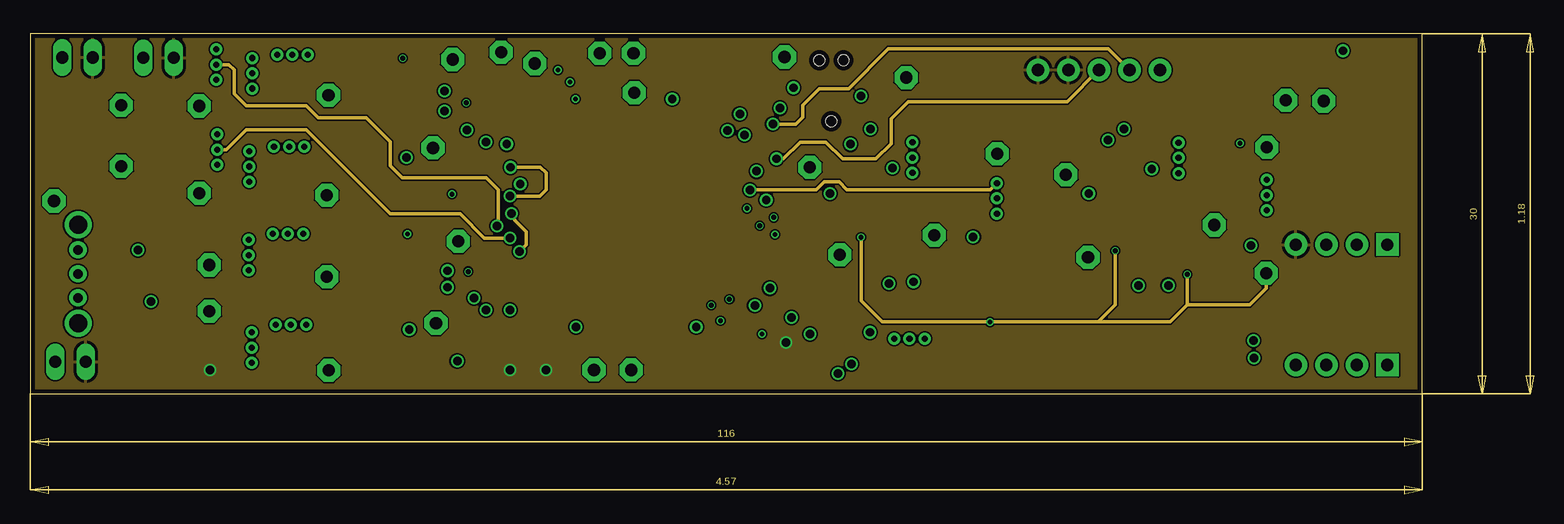
[diagram p8: board, inner layer Route15]
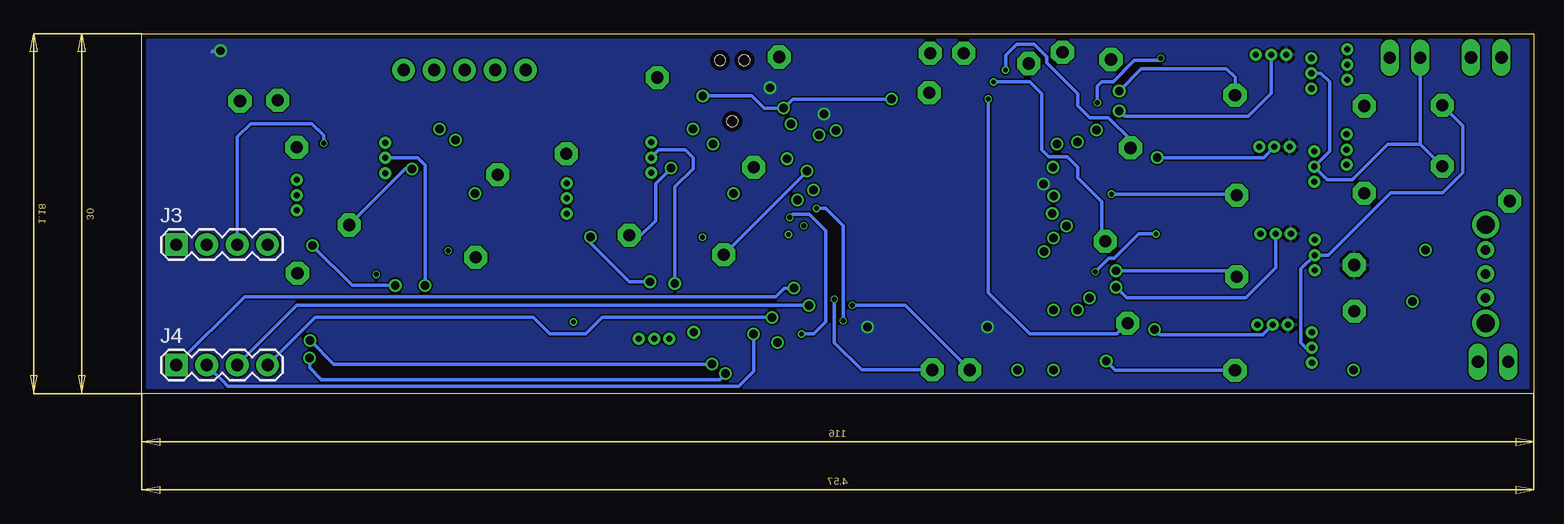
[diagram p9: board, bottom side, seen from below]

Size 116 x 30 mm. Coordinates in mm from the lower left corner, seen from the top.
Outline: 0,0 116,0 116,30 0,30 0,0
Copper layers (1*2*15*16): Top 0.035559375mm / dielectric 0.17018125mm / Route2 0.01778125mm / dielectric 47mil / Route15 0.01778125mm / dielectric 0.17018125mm / Bottom 0.035559375mm
Design rules "OSHPark-4layer": minimum track width 5mil, minimum drill 10mil, track to track 5mil, track to pad 5mil, pad to pad 5mil, via to via 5mil, smd to smd 5mil, copper to edge 15mil, drill to drill 6mil, minimum pad ring 4mil, minimum via ring 4mil, stop-mask expansion 2.5mil, vias tented up to drill 0mil, thermal gap 10mil

### Footprints (pad centres in the part's own frame; a part is rotated, then mirrored left to right if it is on the bottom)
1X02 = drill 1.016 long: 1 -1.27,0; 2 1.27,0
0805 = smd 0.8 x 1.2: 1 -0.9,0; 2 0.9,0
SOD523 = smd 0.7 x 0.5: A 0.7,0; C -0.6,0
SC70-5 = smd 0.4 x 0.7: 1 -0.65,-0.85; 2 0,-0.85; 3 0.65,-0.85; 4 0.65,0.85; 5 -0.65,0.85
1X05 = drill 1.016 pad 1.88: 1 0,0; 2 2.54,0; 3 5.08,0; 4 7.62,0; 5 10.16,0
TC2030-MCP-NL = smd 0.787 x 0.787: 1 1.27,-0.635; 2 1.27,0.635; 3 2.54,-0.635; 4 2.54,0.635; 5 3.81,-0.635; 6 3.81,0.635 | hole 0.889: 0,0; 5.08,-1.016; 5.08,1.016
1X04 = drill 1.016 pad 1.88 square: 1 0,0 | drill 1.016 pad 1.88: 2 2.54,0; 3 5.08,0; 4 7.62,0
1X03-1.27MM = drill 0.508 pad 1: 1 -1.27,0; 2 0,0; 3 1.27,0
1X01 = drill 1.016 pad 1.93 octagon: 1 0,0
CHIP-LED0805 = smd 1.2 x 1.2: A 0,-1.05; C 0,1.05
PZ100 = smd 1.676 x 0.279: 1 -7.62,5.994; 2 -7.62,5.512; 3 -7.62,5.004; 4 -7.62,4.496; 5 -7.62,3.988; 6 -7.62,3.505; 7 -7.62,2.997; 8 -7.62,2.489; 9 -7.62,2.007; 10 -7.62,1.499; 11 -7.62,0.991; 12 -7.62,0.508; 13 -7.62,0; 14 -7.62,-0.508; 15 -7.62,-0.991; 16 -7.62,-1.499; 17 -7.62,-2.007; 18 -7.62,-2.489; 19 -7.62,-2.997; 20 -7.62,-3.505; 21 -7.62,-3.988; 22 -7.62,-4.496; 23 -7.62,-5.004; 24 -7.62,-5.512; 25 -7.62,-5.994; 51 7.62,-5.994; 52 7.62,-5.512; 53 7.62,-5.004; 54 7.62,-4.496; 55 7.62,-3.988; 56 7.62,-3.505; 57 7.62,-2.997; 58 7.62,-2.489; 59 7.62,-2.007; 60 7.62,-1.499; 61 7.62,-0.991; 62 7.62,-0.508; 63 7.62,0; 64 7.62,0.508; 65 7.62,0.991; 66 7.62,1.499; 67 7.62,2.007; 68 7.62,2.489; 69 7.62,2.997; 70 7.62,3.505; 71 7.62,3.988; 72 7.62,4.496; 73 7.62,5.004; 74 7.62,5.512; 75 7.62,5.994 | smd 0.279 x 1.676: 26 -5.994,-7.62; 27 -5.512,-7.62; 28 -5.004,-7.62; 29 -4.496,-7.62; 30 -3.988,-7.62; 31 -3.505,-7.62; 32 -2.997,-7.62; 33 -2.489,-7.62; 34 -2.007,-7.62; 35 -1.499,-7.62; 36 -0.991,-7.62; 37 -0.508,-7.62; 38 0,-7.62; 39 0.508,-7.62; 40 0.991,-7.62; 41 1.499,-7.62; 42 2.007,-7.62; 43 2.489,-7.62; 44 2.997,-7.62; 45 3.505,-7.62; 46 3.988,-7.62; 47 4.496,-7.62; 48 5.004,-7.62; 49 5.512,-7.62; 50 5.994,-7.62; 76 5.994,7.62; 77 5.512,7.62; 78 5.004,7.62; 79 4.496,7.62; 80 3.988,7.62; 81 3.505,7.62; 82 2.997,7.62; 83 2.489,7.62; 84 2.007,7.62; 85 1.499,7.62; 86 0.991,7.62; 87 0.508,7.62; 88 0,7.62; 89 -0.508,7.62; 90 -0.991,7.62; 91 -1.499,7.62; 92 -2.007,7.62; 93 -2.489,7.62; 94 -2.997,7.62; 95 -3.505,7.62; 96 -3.988,7.62; 97 -4.496,7.62; 98 -5.004,7.62; 99 -5.512,7.62; 100 -5.994,7.62
SC82-AB_1PRIMARY = smd 0.406 x 0.914: 1 -1.321,-0.813; 2 -0.025,-0.813; 3 -0.025,1.067; 4 -1.321,1.067
TL3XYO = drill 0.8 pad 1.422: 1 -2,0; 2 0,0; 3 2,0 | drill 1.5 pad 1.93: M1 -4.1,0; M2 4.1,0
TC33X = smd 1.2 x 1.2: 1 -1,-1.825; 3 1,-1.825 | smd 1.5 x 1.6: 2 0,1.5
QFN16 = smd 0.95 x 0.3: 1 -1.6,0.75; 2 -1.6,0.25; 3 -1.6,-0.25; 4 -1.6,-0.75; 9 1.6,-0.75; 10 1.6,-0.25; 11 1.6,0.25; 12 1.6,0.75 | smd 0.3 x 0.95: 5 -0.75,-1.6; 6 -0.25,-1.6; 7 0.25,-1.6; 8 0.75,-1.6; 13 0.75,1.6; 14 0.25,1.6; 15 -0.25,1.6; 16 -0.75,1.6 | smd 1.8 x 1.8: TH 0,0
SOT-23 = smd 0.6 x 1.25: 1 -0.95,-1.075; 2 0.95,-1.075; 3 -0.025,1.075
QFN16' = smd 0.85 x 0.3: 1 -1.475,0.75; 2 -1.475,0.25; 3 -1.475,-0.25; 4 -1.475,-0.75; 9 1.475,-0.75; 10 1.475,-0.25; 11 1.475,0.25; 12 1.475,0.75 | smd 0.3 x 0.85: 5 -0.75,-1.475; 6 -0.25,-1.475; 7 0.25,-1.475; 8 0.75,-1.475; 13 0.75,1.475; 14 0.25,1.475; 15 -0.25,1.475; 16 -0.75,1.475 | smd 1.7 x 1.7: TH 0,0
TSOT23-6 = smd 0.62 x 1.22: 1 -0.95,-1.3; 2 0,-1.3; 3 0.95,-1.3; 4 0.95,1.3; 5 0,1.3; 6 -0.95,1.3
UDFN8 = smd 0.3 x 0.85: 1 -0.75,-1.075; 2 -0.25,-1.075; 3 0.25,-1.075; 4 0.75,-1.075; 5 0.75,1.075; 6 0.25,1.075; 7 -0.25,1.075; 8 -0.75,1.075 | smd 1.6 x 0.45: TH 0,0
SOD-523 = smd 1 x 0.635: ANODE -0.8,0; CATHODE 0.76,0

### Placement (x,y rotation side)
BATT  3.37,2.68 180 top
C1  20.17,17.95 90 top
C2  20.47,25.67 90 top
C3  53.38,26.27 0 top
C4  10.5,13.73 180 top
C5  14.36,13.66 180 top
C6  57,26.73 180 top
C7  38.14,18.26 90 top
C8  57,25 180 top
C9  60.04,26.64 0 top
C10  97.77,26.74 270 top
C11  53.38,28.21 180 top
C12  72.87,14.21 270 top
C13  94.52,13.76 270 top
C14  11,19 0 top
C15  11,24 0 top
C16  20.25,10.77 90 top
C17  20.4,3.03 90 top
D1  2.6,23.75 0 top
D2  2.6,19.17 0 top
D4  77.32,14.01 270 top
D5  100.69,14.48 270 top
HI-LO-1  25.46,12.91 0 top
HI-LO-2  25.35,27.83 0 top
J1  84,27 0 top
J2  66.78,22.72 90 top
J3  113.11,12.44 0 bottom
J4  113.11,2.41 0 bottom
JP1  21.87,28.27 0 top
JP2  98.7,14.08 0 top
JP3  15.52,27.44 90 top
JP4  18.51,26.72 90 top
JP5  18.28,18.95 90 top
JP6  7.6,18.98 0 top
JP7  24.88,24.9 270 top
JP8  35.22,27.87 180 top
JP9  33.59,20.5 180 top
JP10  24.73,16.56 180 top
JP11  14.94,6.9 90 top
JP12  73.02,26.36 0 top
JP13  14.94,10.74 90 top
JP14  2,16.08 90 top
JP15  86.32,18.27 0 top
JP16  88.16,11.38 90 top
JP17  103.07,20.55 90 top
JP18  75.36,13.23 270 top
JP19  64.99,18.88 0 top
JP20  67.49,11.6 270 top
JP21  80.6,20.01 270 top
JP22  107.8,24.41 90 top
JP23  104.65,24.46 90 top
JP24  62.87,28.08 90 top
JP25  50.36,25.1 90 top
JP26  14.1,23.99 90 top
JP27  14.11,16.73 90 top
JP28  24.74,9.76 90 top
JP29  35.7,12.71 270 top
JP30  33.83,5.9 90 top
JP31  24.89,1.96 90 top
JP32  103.01,10.06 0 top
JP33  21.6,20.59 0 top
JP34  18.24,11.57 90 top
JP35  21.49,13.36 0 top
JP36  18.47,3.86 90 top
JP37  21.74,5.77 0 top
JP38  95.71,19.67 90 top
JP39  103.07,16.57 270 top
JP40  73.54,19.69 90 top
JP41  73.29,4.6 0 top
JP42  80.58,16.3 270 top
JP43  15.59,20.36 90 top
JP44  39.26,28.47 0 top
JP45  42.07,27.54 0 top
JP46  50.1,2 90 top
JP47  47,2 90 top
JP48  47.48,28.4 90 top
JP49  50.29,28.4 90 top
LED1  57.03,3.91 90 top
LED2  57.03,1.96 90 top
LO-HI-1  25.4,4.79 0 top
LO-HI-2  25.6,19.59 0 top
MIC  8.14,6.86 0 top
MSP1  50,15 180 top
NCP  11.66,10.49 270 top
R1  22.01,17.95 270 top
R2  22.5,25.66 270 top
R3  31.84,17.55 270 top
R4  33.29,11.16 270 top
R5  6.12,16.56 0 top
R6  11,17 180 top
R7  4,22 0 top
R8  31.01,26.02 90 top
R9  31.79,23.59 180 top
R10  21.82,23.2 180 top
R11  60.05,24.82 180 top
R12  53.62,3.91 180 top
R13  12,8 90 top
R14  10.91,4.28 0 top
R15  8.14,3.38 90 top
R16  105,27.7 90 top
R17  107.52,27.7 90 top
R18  11,22 180 top
R19  79.99,3.14 270 top
R20  82.17,3.14 90 top
R21  71.07,14.22 90 top
R22  73.46,16.51 180 top
R23  92.54,14.55 90 top
R24  94.97,16.44 180 top
R25  53.62,1.96 180 top
R26  33.72,3.05 270 top
R27  22.21,10.77 270 top
R28  22.4,3.03 270 top
R29  31.85,3.07 270 top
R30  32.87,26.14 90 top
R31  31.46,11.16 90 top
R32  32.32,8.78 180 top
R33  21.33,8.16 180 top
R34  33.72,17.55 270 top
S1  4,10 270 top
SOL1  7.6,24.05 180 top
SOLAR1  3.95,28.04 180 top
SOLAR2  10.71,28.01 180 top
TM1  98.99,10.39 0 top
TM2  86.69,14.46 270 top
TM3  76.5,9.3 0 top
TM4  65.24,14.71 270 top
TM5  28.34,25.42 0 top
TM6  28.91,17.95 0 top
TM7  28.61,10.56 0 top
TM8  28.6,3.45 0 top
U3  101.45,27 0 top
U4  77.01,3.32 0 top
U5  MAX547X  [QFN16']  69.21,18.19 270 top
U6  77.8,17.61 180 top
U7  72.14,11.13 90 top
U8  MAX547X  [QFN16']  90.59,18.19 270 top
U9  100.16,17.87 180 top
U10  93.46,10.65 90 top
U11  MAX547X  [QFN16']  38.95,24.02 90 top
U12  MAX547X  [QFN16']  38.98,9.95 90 top
ZENER  89.99,9.48 90 top
ZENER1  69.69,10.12 90 top
ZENER2  7.6,11.14 90 top

### Tracks (layer width: path | path; a pad name or v marks a point on that pad's centre or on a via)
BATT_IN
  Top 0.305: BATT.2 2.11,7.11 3,8 S1.3
CSN  (via drill 0.7)
  Top 0.305: v101.95,4.46 102.96,4.46 104.6,6.1 109.21,6.1 110.57,7.46 J3.2 | v68.47,2.49 67.34,3.62 67.34,8.73 64.02,12.05 59.35,12.05 58.89,12.51 MSP1.8
  Bottom 0.305: v101.95,4.46 99.98,2.49 v68.47,2.49
DIFF_IN1  (via drill 0.7)
  Top 0.305: C2.2 R2.1 | R2.1 | R2.1 24.29,26.57 HI-LO-2.1 24.7,25.08 JP7.1 | v34.53,25.24 R30.1
  Bottom 0.305: JP7.1 24.88,26.37 25.6,27.09 32.68,27.09 v34.53,25.24
DIFF_IN2  (via drill 0.4)
  Top 0.305: C1.2 R1.1 24.84,18.85 LO-HI-2.1 24.95,16.78 JP10.1 | R34.2 v35.17,16.65
  Bottom 0.305: v35.17,16.65 24.82,16.65 JP10.1
DIFF_IN3  (via drill 0.7)
  Top 0.305: C16.2 R27.1 24.42,11.67 | 24.42,11.67 HI-LO-1.1 | R4.2 v34.8,10.26 | 24.42,11.67 24.42,10.08 JP28.1
  Bottom 0.305: v34.8,10.26 25.24,10.26 JP28.1
DIFF_IN4  (via drill 0.7)
  Top 0.305: C17.2 R28.1 LO-HI-1.1 24.75,2.1 JP31.1 | R26.2 35.02,2.15 v35.61,2.74
  Bottom 0.305: JP31.1 24.91,1.98 34.85,1.98 v35.61,2.74
DIFF_POT_1  (via drill 0.4)
  Top 0.305: HI-LO-2.3 28.28,26.98 TM5.2 R8.2 | U11.14 v36.35,24.27 | 31.09,27 R8.2 | v31.06,27.98 31.06,26.97 R8.2
  Bottom 0.305: v36.35,24.27 36.35,25.65 36,26 35.05,26 33.26,27.79 31.25,27.79 v31.06,27.98
DIFF_POT_2
  Top 0.305: LO-HI-2.3 28.2,18.74 TM6.2 31.71,16.65 R3.2 31.84,15.74 32.55,15.03 35.4,15.03 36.09,15.72 36.09,20.61 35.54,21.16 35.54,25.88 35.91,26.25 38.45,26.25 38.7,26 U11.11
DIFF_POT_3  (via drill 0.4)
  Top 0.305: HI-LO-1.3 TM7.2 R31.2 v31.46,13.33 | v36.52,10.19 U12.14
  Bottom 0.305: v31.46,13.33 32.92,13.33 34.93,11.32 35.39,11.32 v36.52,10.19
DIFF_POT_4
  Top 0.305: LO-HI-1.3 27.59,3.94 TM8.2 29.07,4.95 R29.2 | R29.2 31.38,2.17 | R29.2 31.85,1.4 32.35,0.9 35.51,0.9 36.78,2.17 36.78,3.37 35.74,4.41 35.74,10.43 37.7,12.39 38.53,12.39 38.73,12.19 U12.11
ECHO  (via drill 0.7)
  Top 0.305: MSP1.21 59.36,18.99 59.97,19.6 v62.21,19.6
  Route15 0.305: v62.21,19.6 62.79,19.6 64.18,20.99 66.32,20.99 67.73,19.58 70.47,19.58 71.75,20.86 71.75,22.92 73.18,24.35 86.43,24.35 J1.3
ECHO_GATE
  Top 0.305: U6.6 JP42.2
ECHO_POT_1  (via drill 0.7)
  Top 0.305: R22.2 72.42,16.65 72.42,17.53 72.01,17.94 71.58,17.94 | 71.58,17.94 U5.14 | TM3.2 76.5,12.24 75.51,13.23 JP18.1 74.84,12.71 74.84,12.02 74.2,11.38 U7.3 | 71.58,17.94 71.88,18.24 v71.88,18.82
  Bottom 0.305: v71.88,18.82 73.17,17.53 73.17,14.45 74.5,13.12 75.25,13.12 JP18.1
ECHO_POT_2
  Top 0.305: U5.11 69.46,15 | 69.46,15 69.46,14.93 R21.1 U7.5 | 69.46,15 69.17,14.71 TM4.2 64.99,16.46 JP19.1
ECHO_UFOP_GATE  (via drill 0.7)
  Top 0.305: JP42.1 80.58,19.99 JP21.1 | MSP1.18 59.51,17.49 v60,17
  Route15 0.305: v60,17 65.51,17 66.18,17.67 67.42,17.67 68.07,17.02 80.03,17.02 JP42.1
ECHO_UFOP_INT  (via drill 0.7)
  Top 0.305: U7.7 ZENER1.CATHODE 68.97,11.6 JP20.1 | MSP1.19 59.98,18 v60.54,18.56
  Bottom 0.305: JP20.1 v60.54,18.55 v60.54,18.56
ECHO_UFOP_PWR  (via drill 0.7)
  Top 0.305: U5.1 69.98,19.69 JP40.2 74.31,19.69 75,19 75,17.15 R22.1 | U7.8 71.06,9.71 v71.57,9.21
  Bottom 0.305: v71.57,9.21 71.57,17.25 70.05,18.77 70.05,19.69 70.7,20.34 72.89,20.34 JP40.2
ECHO_UFOP_VCC
  Top 0.305: U6.1 78.75,22.75 81,25 92.16,25 J1.5
GDO0  (via drill 0.7)
  Top 0.305: v102,3 103,3 105,5 111,5 113.11,7.11 J3.1 | v67.33,1.69 66.55,2.47 66.55,8.61 63.62,11.54 59.17,11.54 58.71,12 MSP1.7
  Bottom 0.305: v102,3 102,2.18 101.01,1.19 67.83,1.19 v67.33,1.69
GDO2  (via drill 0.7)
  Top 0.305: MSP1.3 60.46,10 v61.65,8.81
  Bottom 0.305: J4.1 107.41,8.11 63.15,8.11 62.45,8.81 v61.65,8.81
GND  (via drill 0.7)
  Top 0.305: U5.10 68.96,17.94 | U5.13 69.96,17.44 U5.TH 68.96,17.94 | U8.10 90.34,17.94 U8.TH 91.34,17.44 U8.13 | U3.2 101.2,27.25 U3.TH | U12.6 39.23,9.7 U12.TH 38.23,10.7 U12.13 | U11.6 39.2,23.77 U11.TH | U5.7 68.96,17.94 | LO-HI-1.2 25.4,3.6 26,3 | U11.13 38.2,24.77 U11.TH | U11.10 39.2,24.27 U11.TH
  other vias: 15,2 40,2 43,2 63.01,4.28
  pour Top: -1,31 -1,-1 121,-1 121,31
  pour Route15: -3,33 -3,-3 123,-3 123,33
HARVESTER_IN
  Top 0.305: JP14.1 2,16 | JP14.1 2,13 3,12 S1.1 | JP14.1 D2.C D1.C
HI-LO-DIFF-1
  Top 0.305: 32.78,27.04 R30.2 34.39,27.04 JP8.1 | HI-LO-2.4 34.41,28.68 JP8.1 | MSP1.51 42.38,24.89 40.74,26.53 38.92,26.53 38.36,27.09 36,27.09 JP8.1
HI-LO-DIFF-2  (via drill 0.4)
  Top 0.305: R4.1 35.05,12.06 JP29.1 34,14.41 26.44,14.41 26.11,14.08 HI-LO-1.4 | MSP1.49 44.49,25.49 v45,26
  Bottom 0.305: v45,26 42,26 41,25 41,20.34 40.41,19.75 38.85,19.75 38,18.9 38,18 36,16 36,13.01 JP29.1
LED_1  (via drill 0.4)
  Top 0.305: MSP1.13 59.29,15 v59.75,15.46 | LED1.A 58.08,5.56 v57.54,6.1
  Bottom 0.305: v59.75,15.46 59,15.46 57.54,14 v57.54,6.1
LED_2  (via drill 0.4)
  Top 0.305: LED2.A 59.96,1.96 61,3 v61,5 | MSP1.12 59.9,14.49 60.61,15.2 61.49,15.2 v61.98,14.71
  Bottom 0.305: v61,5 60,5 59,6 59,13.59 60.37,14.96 61.73,14.96 v61.98,14.71
LO-HI-DIFF-1  (via drill 0.4)
  Top 0.305: LO-HI-2.4 27.2,21.39 32.7,21.39 JP9.1 33.72,20.37 R34.1 | MSP1.50 v44.01,26.99
  Bottom 0.305: JP9.1 33.59,21.16 35.43,23 37,23 38,24 38,25.01 40.57,27.58 40.57,28.1 41.61,29.14 43.07,29.14 44.01,28.2 v44.01,26.99
LO-HI-DIFF-2  (via drill 0.4)
  Top 0.305: MSP1.48 45,24.13 v45.45,24.58 | LO-HI-1.4 26.05,6.04 26.46,6.45 33.28,6.45 JP30.1 33.72,5.79 R26.1
  Bottom 0.305: v45.45,24.58 45.45,8.45 42,5 34.73,5 JP30.1
MISO  (via drill 0.7)
  Top 0.305: MSP1.5 62.99,11.01 65,9 v65,5
  Bottom 0.305: v65,5 65,1.9 66.25,0.65 108.81,0.65 109.16,1 109.81,1.66 J4.2
MOSI  (via drill 0.7)
  Top 0.305: MSP1.4 62.11,10.5 63.44,9.17 v63.44,6.38 v63.45,6.37
  Bottom 0.305: J4.4 101.53,6.37 83.37,6.37 83,6 82.5,5.5 82,5 79,5 77.63,6.37 v63.45,6.37
N$1
  Top 0.305: JP44.1 40.47,28.47 41.33,29.33 44.12,29.33 47,26.45 47,23 MSP1.44
N$2
  Top 0.305: MSP1.45 46.49,26 44.49,28 43,28 42.54,27.54 JP45.1
N$3  (via drill 0.4)
  Top 0.305: MSP1.1 57.62,8.54 v58.28,7.88
  Bottom 0.305: v58.28,7.88 58.28,4.28 56,2 JP46.1
N$4
  Top 0.305: R27.2 22.21,8.18 R33.1 23.51,8.16 24.15,7.52 30.71,7.52 31.42,8.23 R32.2 31.41,8.87
N$5  (via drill 0.4)
  Top 0.305: MSP1.100 v56.77,7.38
  Bottom 0.305: v56.77,7.38 52.38,7.38 JP47.1
N$6
  Top 0.305: MSP1.42 47.99,26.1 JP49.1
N$7
  Top 0.305: R12.1 LED1.C
N$8
  Top 0.305: R2.2 22.5,23.42 R10.1 23.69,23.2 24.54,22.35 30.26,22.35 30.89,22.98 R9.2
N$9
  Top 0.305: R25.1 LED2.C
N$10
  Top 0.305: MSP1.43 47.51,28.37 JP48.1
N$11
  Top 0.305: MIC.3 10.91,6.01 10.95,6.05 | 10.95,6.05 R13.1 | R14.2 11.81,5.19 10.95,6.05
N$12
  Top 0.305: MIC.1 7.49,4.93 R15.2 R14.1
N$13
  Top 0.305: U3.5 98.21,25.4 C10.2
N$14
  Top 0.305: U4.2 R19.2
N$17
  Top 0.305: R21.2 C12.1 75.65,15.11 U6.4 U6.5 77.8,15.09 D4.C
N$20  (via drill 0.7)
  Top 0.305: U7.1 73.22,9.76 v73.62,9.35 | D4.A 78.37,13.31 v78.6,13.08
  Bottom 0.305: v73.62,9.35 75.35,9.35 78.6,12.6 v78.6,13.08
N$22
  Top 0.305: R23.2 93.73,15.45 C13.1 96.4,14.66 98.31,16.57 U9.4 U9.5 100.16,15.61 D5.C
N$24  (via drill 0.7)
  Top 0.305: U10.1 94.53,9.38 v94.86,9.05 | v101.76,12.36 101.76,12.71 D5.A
  Bottom 0.305: v94.86,9.05 98.45,9.05 v101.76,12.36
POWER_IN
  Top 0.305: S1.2 5.7,10 | 5.7,10 ZENER2.CATHODE 7.6,13.01 8.32,13.73 C4.2 | 5.7,10 5.7,8.63 6.62,7.71 MIC.5 8.68,8.9 R13.2 12.94,8.9 JP11.1
RADIO_GATE
  Top 0.305: U9.6 JP39.2
RADIO_POT_1  (via drill 0.7)
  Top 0.305: R24.2 94.07,17.5 93.63,17.94 92.67,17.94 | 98.99,12.3 TM1.2 98.7,12.18 JP2.1 97.25,14.08 96.67,13.5 96.67,11.84 95.73,10.9 U10.3 | 92.67,17.94 v93.48,18.75 | U8.14 92.67,17.94
  Bottom 0.305: v93.48,18.75 94.03,18.75 JP2.1
RADIO_POT_2
  Top 0.305: U8.11 90.84,15.35 | 90.84,15.35 R23.1 92.34,13.46 U10.5 | 90.84,15.35 89.95,14.46 TM2.2 86.32,16.33 JP15.1
RADIO_UFOP_GATE  (via drill 0.7)
  Top 0.305: JP39.1 JP17.1 | MSP1.9 59.1,12.99 59.58,12.51 65.09,12.51 65.91,11.69 65.91,10.93 69.99,6.85 v69.99,5.14
  Route2 0.305: v69.99,5.14 69.99,5.99 71,7 97,7 100,10 100,12.43 101.16,13.59 101.16,15.93 JP39.1
RADIO_UFOP_INT  (via drill 0.4)
  Top 0.305: U10.7 90.15,10.4 ZENER.CATHODE 88.85,11.38 JP16.1 | MSP1.10 59.5,13.5 60,13 61.81,13 v62.09,13.28
  Route2 0.305: JP16.1 71.38,11.38 70,10 67,10 66,11 66,12 64.72,13.28 v62.09,13.28
RADIO_UFOP_PWR  (via drill 0.7)
  Top 0.305: U8.1 JP38.2 | JP38.2 | R24.1 96.54,16.44 97,16.9 97,19 96.33,19.67 96.33,19.66 JP38.2 | U10.8 92.39,9.04 v92.37,9.03
  Bottom 0.305: v92.37,9.03 92.37,19.04 93,19.66 JP38.2
RADIO_UFOP_VCC  (via drill 0.4)
  Top 0.305: U9.1 101.11,20.61 v100.83,20.89
  Bottom 0.305: v100.83,20.89 100.83,21.55 101.81,22.53 106.91,22.53 108.03,21.41 J3.3
REF  (via drill 0.4)
  Top 0.305: U7.6 70.5,11.38 69.25,12.63 v69.25,13.05 | R19.1 v80,6 80,7.73 78.59,9.14 75.43,9.14 73.69,10.88 U7.2 | R19.1 | U10.6 91.47,10.9 v90.44,11.93 | U10.2 96,10.4 v96.44,9.96 | R19.1 R20.2
  Route15 0.305: v69.25,13.05 69.25,7.75 71,6 v80,6 89,6 | v90.44,11.93 90.44,7.44 89,6 | v96.44,9.96 96.44,7.44 | 96.44,7.44 95,6 89,6 | JP32.1 103.01,8.82 101.64,7.45 96.45,7.45 96.44,7.44
REFPWR
  Top 0.305: U4.1 75.64,2.25 JP41.2
RST  (via drill 0.7)
  Top 0.305: C11.1 C3.2 54.5,26.05 MSP1.29 54.5,23.59 v53.52,24.57 50.89,24.57 JP25.1 | R11.1 61.49,24.82 v62.5,23.81 | v69.24,24.84 69.24,24.24 68.99,23.99 J2.1
  Bottom 0.305: v53.52,24.57 61.74,24.57 v62.5,23.81 64.1,23.81 65.14,24.85 v69.23,24.85 v69.24,24.84
SCL_CTRL  (via drill 0.7)
  Top 0.305: MSP1.25 57.62,21.42 v58.14,21.94 | U5.2 69.45,21.49 v70.04,22.08 | U8.2 90.84,21.75 v91.17,22.08 | R16.1 104.65,26.45 JP23.1 104.19,24 102,24 101.7,24.3 U3.7 | U11.2 38.7,21.45 38.25,21 v38,21 | v38,7 38.48,7 38.73,7.25 U12.2
  Route2 0.305: JP23.1 104.19,24 94,24 92.08,22.08 v91.17,22.08 89.74,23.51 70.88,23.51 70.04,22.67 v70.04,22.08 70.02,22.1 68.42,22.1 67.69,21.37 61.11,21.37 60.03,22.45 58.65,22.45 v58.14,21.94 38.94,21.94 v38,21 v38,7
SCLK  (via drill 0.7)
  Top 0.305: MSP1.2 59.74,9.49 60.39,8.84 v60.39,7.38 v60.4,7.37
  Bottom 0.305: v60.4,7.37 103.07,7.37 J4.3
SDA_CTRL  (via drill 0.7)
  Top 0.305: MSP1.24 59.09,20.51 59.54,20.96 v59.54,21.57 | U5.3 68.96,20.41 68.56,20.81 v68.38,20.81 | U8.3 90.34,20.65 v89.84,21.15 | U3.6 101.2,23.73 102.15,22.78 106.17,22.78 JP22.1 107.8,26.52 R17.1 | v39.73,20.81 39.68,20.81 39.2,21.29 U11.3 | v40,7 39.7,7 39.23,7.47 U12.3
  Route2 0.305: 60.3,20.81 v59.54,21.57 | 60.3,20.81 v68.38,20.81 71.11,20.81 72.61,22.31 88.68,22.31 v89.84,21.15 90.34,20.65 92.65,20.65 95,23 106.39,23 JP22.1 | 60.3,20.81 v39.73,20.81 39.73,20.27 40,20 41,20 42,19 42,9 v40,7
SOLAR1
  Top 0.305: SOLAR1.2 2.68,24.37 D1.A | R7.1 3.1,23.55 D1.A | D1.A 7.3,23.75 SOL1.1
  Bottom 0.305: SOL1.1 5.9,22.35 5.9,18.44 7.57,16.77 11.9,16.77 17.1,11.57 JP34.2 19.39,10.42 19.39,4.27 18.98,3.86 JP36.2
SOLAR1-1
  Top 0.305: JP34.1 19.82,10.3 C16.1
SOLAR1-2
  Top 0.305: JP36.1 19.94,2.59 C17.1
SOLAR1IN
  Top 0.305: R7.2 R18.2 10.1,22.2 C15.2 JP26.1 15.52,25.41 JP3.1
SOLAR1MC  (via drill 0.7)
  Top 0.305: MSP1.65 38.93,14.01 v38.91,13.99
  Route15 0.305: JP3.2 16.56,27.44 17,27 17,25 18,24 23,24 24,23 28,23 30,21 30,19 31,18 38,18 39,17 39,14.08 v38.91,13.99
SOLAR2
  Top 0.305: JP6.1 7.41,19.17 D2.A 3.1,18.97 3.1,17.98 4.52,16.56 R5.1
  Bottom 0.305: SOLAR2.2 9.44,20.82 | 9.44,20.82 JP6.1 | 9.44,20.82 12.14,20.82 15.1,17.86 17.19,17.86 JP5.2 17,20.23 17,26 17.72,26.72 JP4.2
SOLAR2-1
  Top 0.305: JP4.1 19.79,25.45 C2.1
SOLAR2-2
  Top 0.305: JP5.1 19.54,17.68 C1.1
SOLAR2IN
  Top 0.305: R5.2 9.66,16.56 R6.2 C14.2 11.9,18.94 JP27.1 15.59,18.21 JP43.1
SOLAR2MC  (via drill 0.7)
  Top 0.305: v40,13 40,13.24 40.26,13.5 MSP1.66
  Route15 0.305: JP43.2 16.36,20.36 18,22 23,22 30,15 35.84,15 37.85,12.99 v39.99,12.99 v40,13
TEST
  Top 0.305: MSP1.28 55,28 55.96,28.96 61.99,28.96 JP24.1 64.42,26.53 J2.6
TLVPWR1  (via drill 0.7)
  Top 0.305: HI-LO-2.5 23.95,29.43 22.21,29.43 21.87,29.09 JP1.2 | R8.1 31.16,25.12 R9.1 32.71,23.57 v34.53,23.57
  Bottom 0.305: JP1.2 21.87,25.05 23.8,23.12 34.08,23.12 v34.53,23.57
TLVPWR2  (via drill 0.7)
  Top 0.305: JP33.2 21.6,21.24 22,21.64 24.34,21.64 24.86,21.12 24.86,20.53 LO-HI-2.5 | R3.1 31.84,19.22 v31.36,19.7
  Bottom 0.305: v31.36,19.7 22.49,19.7 JP33.2
TLVPWR3  (via drill 0.7)
  Top 0.305: HI-LO-1.5 24.05,14.52 22.15,14.52 21.49,13.86 JP35.2 | R31.1 31.86,10.26 31.86,10.14 R32.1 34.69,8.78 v34.8,8.89
  Bottom 0.305: JP35.2 21.49,10.51 24,8 33.91,8 v34.8,8.89
TLVPWR4  (via drill 0.7)
  Top 0.305: JP37.2 21.74,6.51 22.07,6.84 24.36,6.84 24.74,6.46 LO-HI-1.5 | R29.1 31.85,5.13 v31.6,5.38
  Bottom 0.305: JP37.2 22.57,4.94 31.16,4.94 v31.6,5.38
TRIG  (via drill 0.7)
  Top 0.305: MSP1.22 58.74,19.5 59.56,20.32 60.77,20.32 61.83,21.38 61.83,22.41 v61.9,22.48
  Route15 0.305: J1.4 89.86,28.76 71.53,28.76 68.22,25.45 65.78,25.45 64.39,24.06 64.39,23.06 63.81,22.48 v61.9,22.48
VCC  (via drill 0.7)
  Top 0.305: NCP.3 14.71,10.52 JP13.1 15.26,11.06 C5.1 | MSP1.27 55.51,23.59 55.83,23.91 57.38,23.91 57.82,24.35 57.82,24.92 C8.1 | C8.1 C6.1 | C8.1 57.9,25.4 C9.1 | C8.1 58.97,25 R11.2 v59.15,23.32 | MSP1.79 v45.5,5.58 | MSP1.99 55.51,5.78 v55.52,5.58 | R17.2 R16.2 U3.13 v109.41,28.6 | MSP1.58 v40.85,17.49 38.27,17.49 C7.1 | J2.2 65.15,23.99 v63.63,25.51
  Bottom 0.305: 110.01,28.6 110.11,28.5
  pour Bottom: -4,34 -4,-4 124,-4 124,34
VIN  (via drill 0.7)
  Top 0.305: NCP.4 NCP.1 10.66,12 v9,12 | MIC.4 v10.09,7.71 | U11.1 36.98,22.55 v36.43,22 | U12.1 37.48,8.47 v37,8
  Route2 0.305: v9,12 9,8.8 v10.09,7.71
  pour Route2: -2,32 -2,-2 122,-2 122,32
WP_CTRL_DIFF_1  (via drill 0.7)
  Top 0.305: MSP1.60 v40,16.5 v39.99,16.49 | U11.9 39.7,25.89 39.9,26.09 40.46,26.09 41.9,24.65 41.9,22.19 41.06,21.35 41.06,19.77 40.18,18.89 v40.04,18.89
  Route15 0.305: v39.99,16.49 42.49,16.49 43,17 43,18.41 42.52,18.89 v40.04,18.89
WP_CTRL_DIFF_2  (via drill 0.7)
  Top 0.305: MSP1.61 41.02,15.99 40.42,15.39 v40.11,15.05 | v40.8,11.86 40.16,11.86 U12.9
  Route15 0.305: v40.8,11.86 41.37,12.43 41.37,13.5 40.42,14.45 v40.11,15.05
WP_CTRL_ECHO  (via drill 0.7)
  Top 0.305: U5.9 v66.67,16.71 v66.66,16.71 | MSP1.14 58.55,15.51 59.2,16.16 v61.35,16.16
  Route2 0.305: v66.66,16.71 61.9,16.71 v61.35,16.16
WP_CTRL_RADIO  (via drill 0.4, 0.7)
  Top 0.305: U8.9 v88.23,16.71 | MSP1.11 60.15,14 v60.82,14.01
  Route2 0.305: v88.23,16.71 87.71,16.71 87,16 84,16 81.17,13.17 80.26,13.17 79.43,14 78,14 77,15 69,15 68.01,14.01 v60.82,14.01

### Text on the board
tPlace: - | - | Waldo Rev. C / Designed by: / Harsh Desai | Clemson University / PERSIST LAB | CS | GDO1 | + | MOSI | SCLK | MISO | GDO2 | TX | RX